# EAGLE design LoraLCD (EAGLE 9.6.0)

## Sheet 1 of 8: Mikrokontroller
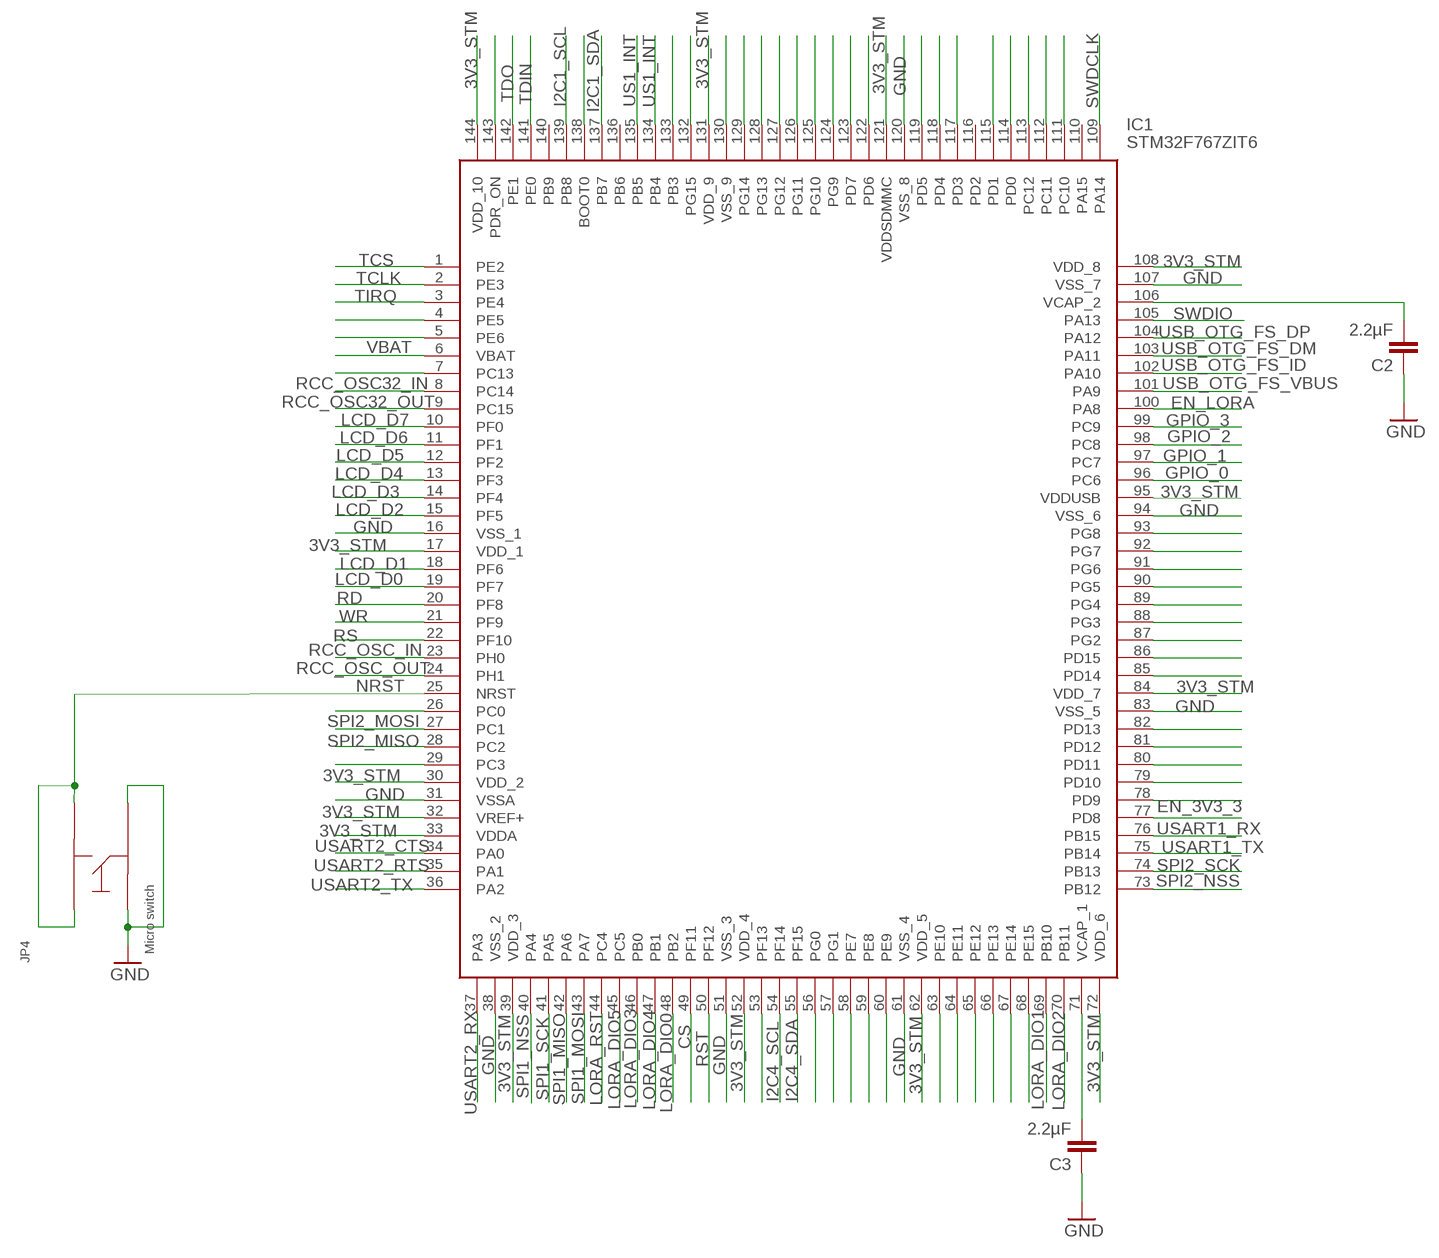
[diagram p0: schematic, sheet 1]

### Parts
C2  2.2µF  C-EUC0402K  [C0402K]
C3  2.2µF  C-EUC0402K  [C0402K]
IC1  STM32F767ZIT6  [QFP50P2200X2200X160-144N]
JP4  MICRO_SWITCH_6MM  [SKQGADE010]

### Nets
3V3_STM: IC1.17(VDD_1) IC1.30(VDD_2) IC1.32(VREF+) IC1.33(VDDA) IC1.39(VDD_3) IC1.52(VDD_4) IC1.62(VDD_5) IC1.72(VDD_6) IC1.84(VDD_7) IC1.95(VDDUSB) IC1.108(VDD_8) IC1.121(VDDSDMMC) IC1.131(VDD_9) IC1.144(VDD_10) ; also sheet 2
CS: IC1.49(PF11) ; also sheet 8
EN_3V3_3: IC1.77(PD8) ; also sheet 6
EN_LORA: IC1.100(PA8) ; also sheet 5
GND: C2.1 C3.1 IC1.16(VSS_1) IC1.31(VSSA) IC1.38(VSS_2) IC1.51(VSS_3) IC1.61(VSS_4) IC1.83(VSS_5) IC1.94(VSS_6) IC1.107(VSS_7) IC1.120(VSS_8) JP4.P$3 JP4.P$4 ; also sheet 2,3,4,5,6,7,8
GPIO_0: IC1.96(PC6) ; also sheet 6
GPIO_1: IC1.97(PC7) ; also sheet 6
GPIO_2: IC1.98(PC8) ; also sheet 6
GPIO_3: IC1.99(PC9) ; also sheet 6
I2C1_SCL: IC1.139(PB8) ; also sheet 6,7
I2C1_SDA: IC1.137(PB7) ; also sheet 6,7
I2C4_SCL: IC1.54(PF14) ; also sheet 6,7
I2C4_SDA: IC1.55(PF15) ; also sheet 6,7
LCD_D0: IC1.19(PF7) ; also sheet 8
LCD_D1: IC1.18(PF6) ; also sheet 8
LCD_D2: IC1.15(PF5) ; also sheet 8
LCD_D3: IC1.14(PF4) ; also sheet 8
LCD_D4: IC1.13(PF3) ; also sheet 8
LCD_D5: IC1.12(PF2) ; also sheet 8
LCD_D6: IC1.11(PF1) ; also sheet 8
LCD_D7: IC1.10(PF0) ; also sheet 8
LORA_DIO0: IC1.48(PB2) ; also sheet 5
LORA_DIO1: IC1.69(PB10) ; also sheet 5
LORA_DIO2: IC1.70(PB11) ; also sheet 5
LORA_DIO3: IC1.46(PB0) ; also sheet 5
LORA_DIO4: IC1.47(PB1) ; also sheet 5
LORA_DIO5: IC1.45(PC5) ; also sheet 5
LORA_RST: IC1.44(PC4) ; also sheet 5
N$4: IC1.4(PE5)
N$5: IC1.5(PE6)
N$6: C2.2 IC1.106(VCAP_2)
N$7: IC1.7(PC13)
N$26: IC1.26(PC0)
N$29: IC1.29(PC3)
N$53: IC1.53(PF13)
N$56: IC1.56(PG0)
N$57: IC1.57(PG1)
N$58: IC1.58(PE7)
N$59: IC1.59(PE8)
N$60: IC1.60(PE9)
N$63: IC1.63(PE10)
N$64: IC1.64(PE11)
N$65: IC1.65(PE12)
N$66: IC1.66(PE13)
N$67: IC1.67(PE14)
N$68: IC1.68(PE15)
N$71: C3.2 IC1.71(VCAP_1)
N$88: IC1.93(PG8)
N$89: IC1.92(PG7)
N$90: IC1.91(PG6)
N$91: IC1.90(PG5)
N$92: IC1.89(PG4)
N$93: IC1.88(PG3)
N$94: IC1.87(PG2)
N$95: IC1.86(PD15)
N$96: IC1.85(PD14)
N$99: IC1.82(PD13)
N$100: IC1.81(PD12)
N$101: IC1.80(PD11)
N$102: IC1.79(PD10)
N$103: IC1.78(PD9)
N$110: IC1.143(PDR_ON)
N$115: IC1.138(BOOT0)
N$120: IC1.133(PB3)
N$121: IC1.132(PG15)
N$123: IC1.130(VSS_9)
N$124: IC1.129(PG14)
N$125: IC1.128(PG13)
N$126: IC1.127(PG12)
N$127: IC1.126(PG11)
N$128: IC1.125(PG10)
N$129: IC1.124(PG9)
N$130: IC1.123(PD7)
N$131: IC1.122(PD6)
N$134: IC1.119(PD5)
N$135: IC1.118(PD4)
N$136: IC1.117(PD3)
N$138: IC1.115(PD1)
N$139: IC1.114(PD0)
N$140: IC1.113(PC12)
N$141: IC1.112(PC11)
N$142: IC1.111(PC10)
NRST: IC1.25(NRST) JP4.P$1 JP4.P$2 ; also sheet 2
RCC_OSC32_IN: IC1.8(PC14) ; also sheet 3
RCC_OSC32_OUT: IC1.9(PC15) ; also sheet 3
RCC_OSC_IN: IC1.23(PH0) ; also sheet 3
RCC_OSC_OUT: IC1.24(PH1) ; also sheet 3
RD: IC1.20(PF8) ; also sheet 8
RS: IC1.22(PF10) ; also sheet 8
RST: IC1.50(PF12) ; also sheet 8
SPI1_MISO: IC1.42(PA6) ; also sheet 5
SPI1_MOSI: IC1.43(PA7) ; also sheet 5
SPI1_NSS: IC1.40(PA4) ; also sheet 5
SPI1_SCK: IC1.41(PA5) ; also sheet 5
SPI2_MISO: IC1.28(PC2) ; also sheet 6,7
SPI2_MOSI: IC1.27(PC1) ; also sheet 6
SPI2_NSS: IC1.73(PB12) ; also sheet 6
SPI2_SCK: IC1.74(PB13) ; also sheet 6,7
SWDCLK: IC1.109(PA14) ; also sheet 2
SWDIO: IC1.105(PA13) ; also sheet 2
TCLK: IC1.2(PE3) ; also sheet 8
TCS: IC1.1(PE2) ; also sheet 8
TDIN: IC1.141(PE0) ; also sheet 8
TDO: IC1.142(PE1) ; also sheet 8
TIRQ: IC1.3(PE4) ; also sheet 8
US1_INT: IC1.134(PB4) IC1.135(PB5) ; also sheet 6
USART1_RX: IC1.76(PB15) ; also sheet 6
USART1_TX: IC1.75(PB14) ; also sheet 6
USART2_CTS: IC1.34(PA0) ; also sheet 6
USART2_RTS: IC1.35(PA1) ; also sheet 6
USART2_RX: IC1.37(PA3) ; also sheet 6
USART2_TX: IC1.36(PA2) ; also sheet 6
USB_OTG_FS_DM: IC1.103(PA11) ; also sheet 6
USB_OTG_FS_DP: IC1.104(PA12) ; also sheet 6
USB_OTG_FS_ID: IC1.102(PA10) ; also sheet 6
USB_OTG_FS_VBUS: IC1.101(PA9) ; also sheet 6
VBAT: IC1.6(VBAT) ; also sheet 4,6
WR: IC1.21(PF9) ; also sheet 8
Unconnected: IC1.110(PA15) IC1.116(PD2) IC1.136(PB6) IC1.140(PB9)

## Sheet 2 of 8: SWD - Code Laden
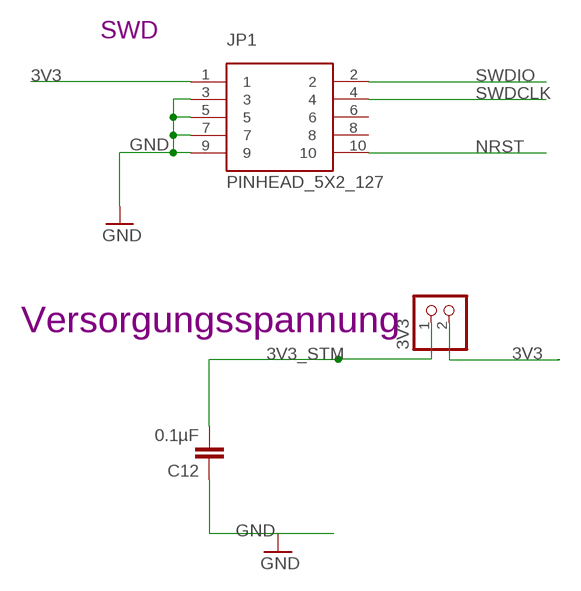
[diagram p1: schematic, sheet 2]

### Parts
3V3  PINHD-1X2  [1X02]
C12  0.1µF  C-EUC0402K  [C0402K]
JP1  PINHEAD_5X2_127  [PINHEAD_2X5_127]

### Nets
3V3: 3V3.2 JP1.1 ; also sheet 4,5,6,7,8
3V3_STM: 3V3.1 C12.2 ; also sheet 1
GND: C12.1 JP1.3 JP1.5 JP1.7 JP1.9 ; also sheet 1,3,4,5,6,7,8
NRST: JP1.10 ; also sheet 1
SWDCLK: JP1.4 ; also sheet 1
SWDIO: JP1.2 ; also sheet 1
Unconnected: JP1.6 JP1.8

### Notes on the sheet
- SWD
- Versorgungsspannung

## Sheet 3 of 8: Oszillator
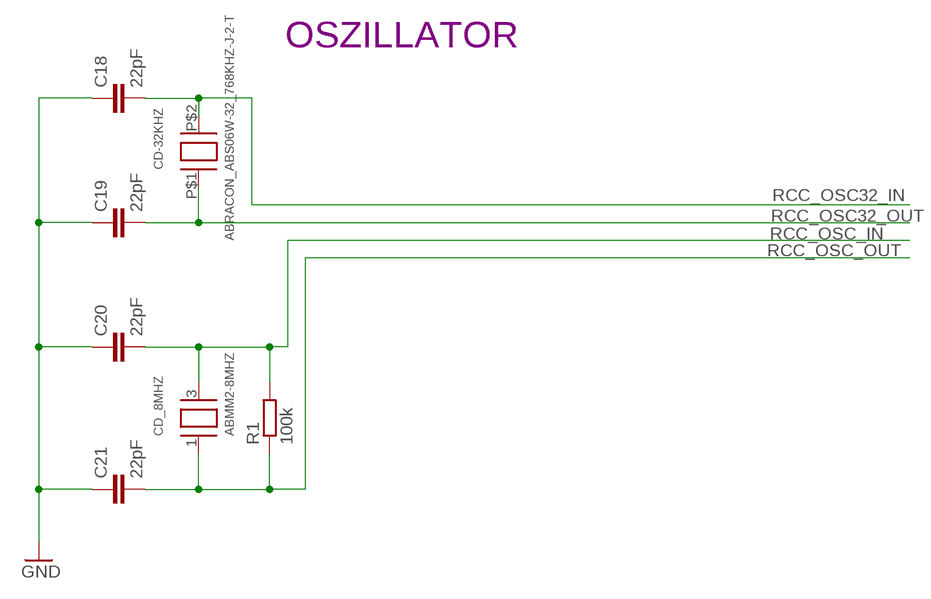
[diagram p2: schematic, sheet 3]

### Parts
C18  22pF  C-EUC0402K  [C0402K]
C19  22pF  C-EUC0402K  [C0402K]
C20  22pF  C-EUC0402K  [C0402K]
C21  22pF  C-EUC0402K  [C0402K]
CD-32KHZ  ABRACON_ABS06W-32_768KHZ-J-2-T  [2MM_X_1_2MM]
CD_8MHZ  ABMM2-8MHZ  [CRYSTAL_ABRACON_6MM_3.6MM]
R1  100k  R_0402WEB_0402  [C0402K]

### Nets
GND: C18.1 C19.1 C20.1 C21.1 ; also sheet 1,2,4,5,6,7,8
RCC_OSC32_IN: C18.2 CD-32KHZ.P$2(C1) ; also sheet 1
RCC_OSC32_OUT: C19.2 CD-32KHZ.P$1(C0) ; also sheet 1
RCC_OSC_IN: C20.2 CD_8MHZ.3(C1) R1.2 ; also sheet 1
RCC_OSC_OUT: C21.2 CD_8MHZ.1(C0) R1.1 ; also sheet 1

### Notes on the sheet
- OSZILLATOR

## Sheet 4 of 8: Supply
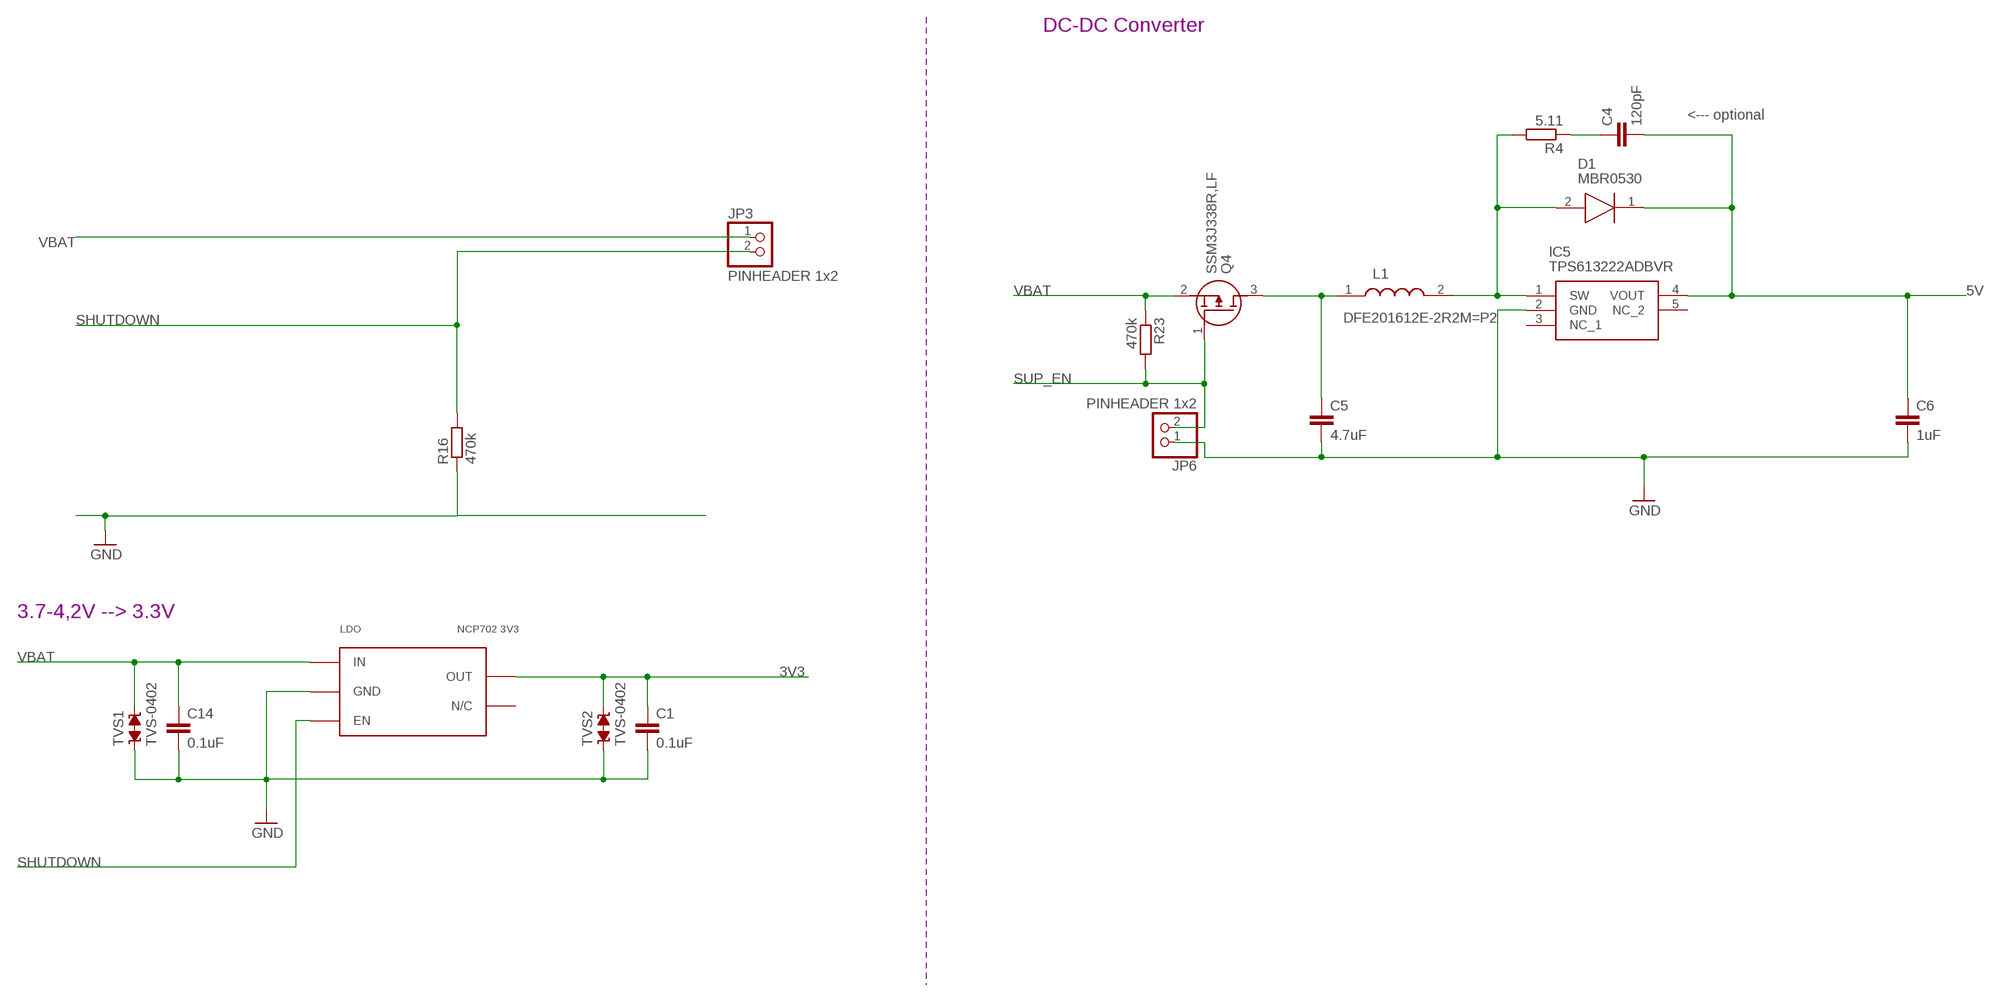
[diagram p3: schematic, sheet 4]

### Parts
C1  0.1uF  C-EUC0402K  [C0402K]
C4  120pF  C-EUC0402K  [C0402K]
C5  4.7uF  C-EUC0603K  [C0603K]
C6  1uF  C-EUC0603K  [C0603K]
C14  0.1uF  C-EUC0402K  [C0402K]
D1  MBR0530  [SOD3716X135N]
IC5  TPS613222ADBVR  [SOT95P280X145-5N]
JP3  PINHEADER 1x2  PINHD-1X2  [1X02]
JP6  PINHEADER 1x2  PINHD-1X2  [1X02]
L1  DFE201612E-2R2M=P2  [INDC2016X120N]
LDO  NCP702 3V3  NCP702  [SOT563]
Q4  SSM3J338R,LF  [SSM3J332RLFT]
R4  5.11  R-EU_R0402  [R0402]
R16  470k  R-EU_R0402  [R0402]
R23  470k  R-EU_R0402  [R0402]
TVS1  TVS-0402  [TVS0402]
TVS2  TVS-0402  [TVS0402]

### Nets
3V3: C1.1 LDO.P$5(OUT) TVS2.2 ; also sheet 2,5,6,7,8
5V: C4.2 C6.1 D1.1(K) IC5.4(VOUT) ; also sheet 6,8
GND: C1.2 C5.2 C6.2 C14.2 IC5.2(GND) JP6.1 LDO.P$2(GND) R16.1 TVS1.1 TVS2.1 ; also sheet 1,2,3,5,6,7,8
N$8: D1.2(A) IC5.1(SW) L1.2 R4.2
N$9: C4.1 R4.1
N$16: C5.1 L1.1 Q4.3(D)
SHUTDOWN: JP3.2 LDO.P$3(EN) R16.2
SUP_EN: JP6.2 Q4.1(G) R23.2
VBAT: C14.1 JP3.1 LDO.P$1(IN) Q4.2(S) R23.1 TVS1.2 ; also sheet 1,6
Unconnected: IC5.3(NC_1) IC5.5(NC_2) LDO.P$4(N/C)

### Notes on the sheet
- DC-DC Converter
- <--- optional
- 3.7-4,2V --> 3.3V

## Sheet 5 of 8: Lora
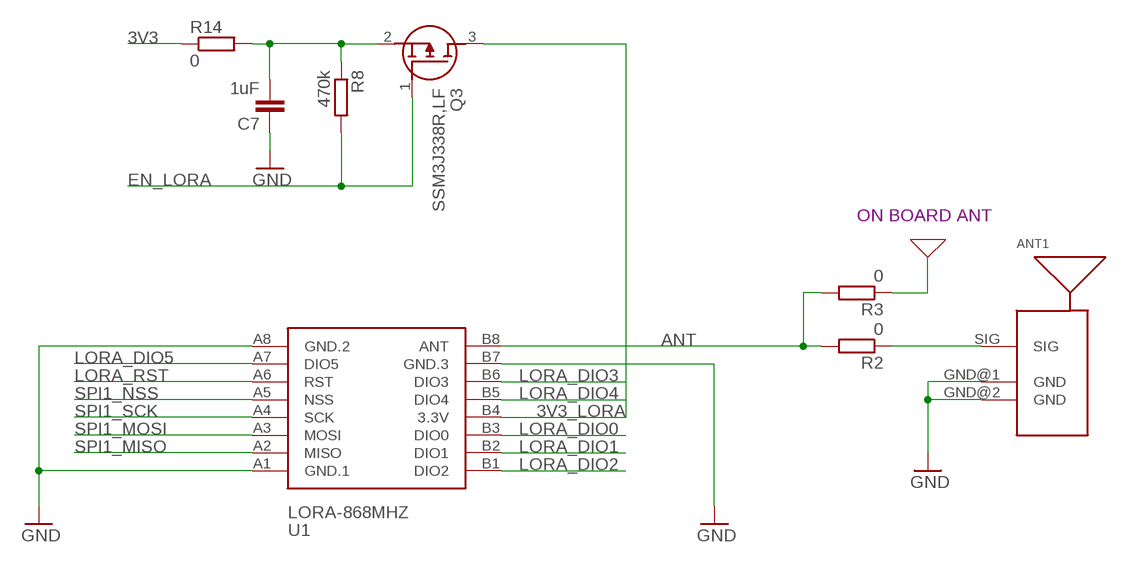
[diagram p4: schematic, sheet 5]

### Parts
ANT1  U.FL-R-SMT-1  [UFL_HIROSE]
C7  1uF  C-EUC0402K  [C0402K]
Q3  SSM3J338R,LF  [SSM3J332RLFT]
R2  0  R_0402WEB_0402  [C0402K]
R3  0  R_0402WEB_0402  [C0402K]
R8  470k  R-EU_R0402  [R0402]
R14  0  R-EU_R0402  [R0402]
U1  LORA-868MHZ  WIRELESS-LORA-RFM95W#SMD  [WIRELESS-LORA-RFM95W#SMD]

### Nets
3V3: R14.1 ; also sheet 2,4,6,7,8
3V3_LORA: Q3.3(D) U1.B4(3.3V)
ANT: R2.2 R3.2 U1.B8(ANT)
EN_LORA: Q3.1(G) R8.2 ; also sheet 1
GND: ANT1.GND@1(GND) ANT1.GND@2(GND) C7.1 U1.A1(GND.1) U1.A8(GND.2) U1.B7(GND.3) ; also sheet 1,2,3,4,6,7,8
HELIX_ANT: R3.1
LORA_DIO0: U1.B3(DIO0) ; also sheet 1
LORA_DIO1: U1.B2(DIO1) ; also sheet 1
LORA_DIO2: U1.B1(DIO2) ; also sheet 1
LORA_DIO3: U1.B6(DIO3) ; also sheet 1
LORA_DIO4: U1.B5(DIO4) ; also sheet 1
LORA_DIO5: U1.A7(DIO5) ; also sheet 1
LORA_RST: U1.A6(RST) ; also sheet 1
N$17: ANT1.SIG R2.1
N$23: C7.2 Q3.2(S) R8.1 R14.2
SPI1_MISO: U1.A2(MISO) ; also sheet 1
SPI1_MOSI: U1.A3(MOSI) ; also sheet 1
SPI1_NSS: U1.A5(NSS) ; also sheet 1
SPI1_SCK: U1.A4(SCK) ; also sheet 1

### Notes on the sheet
- ON BOARD ANT

## Sheet 6 of 8: Connector
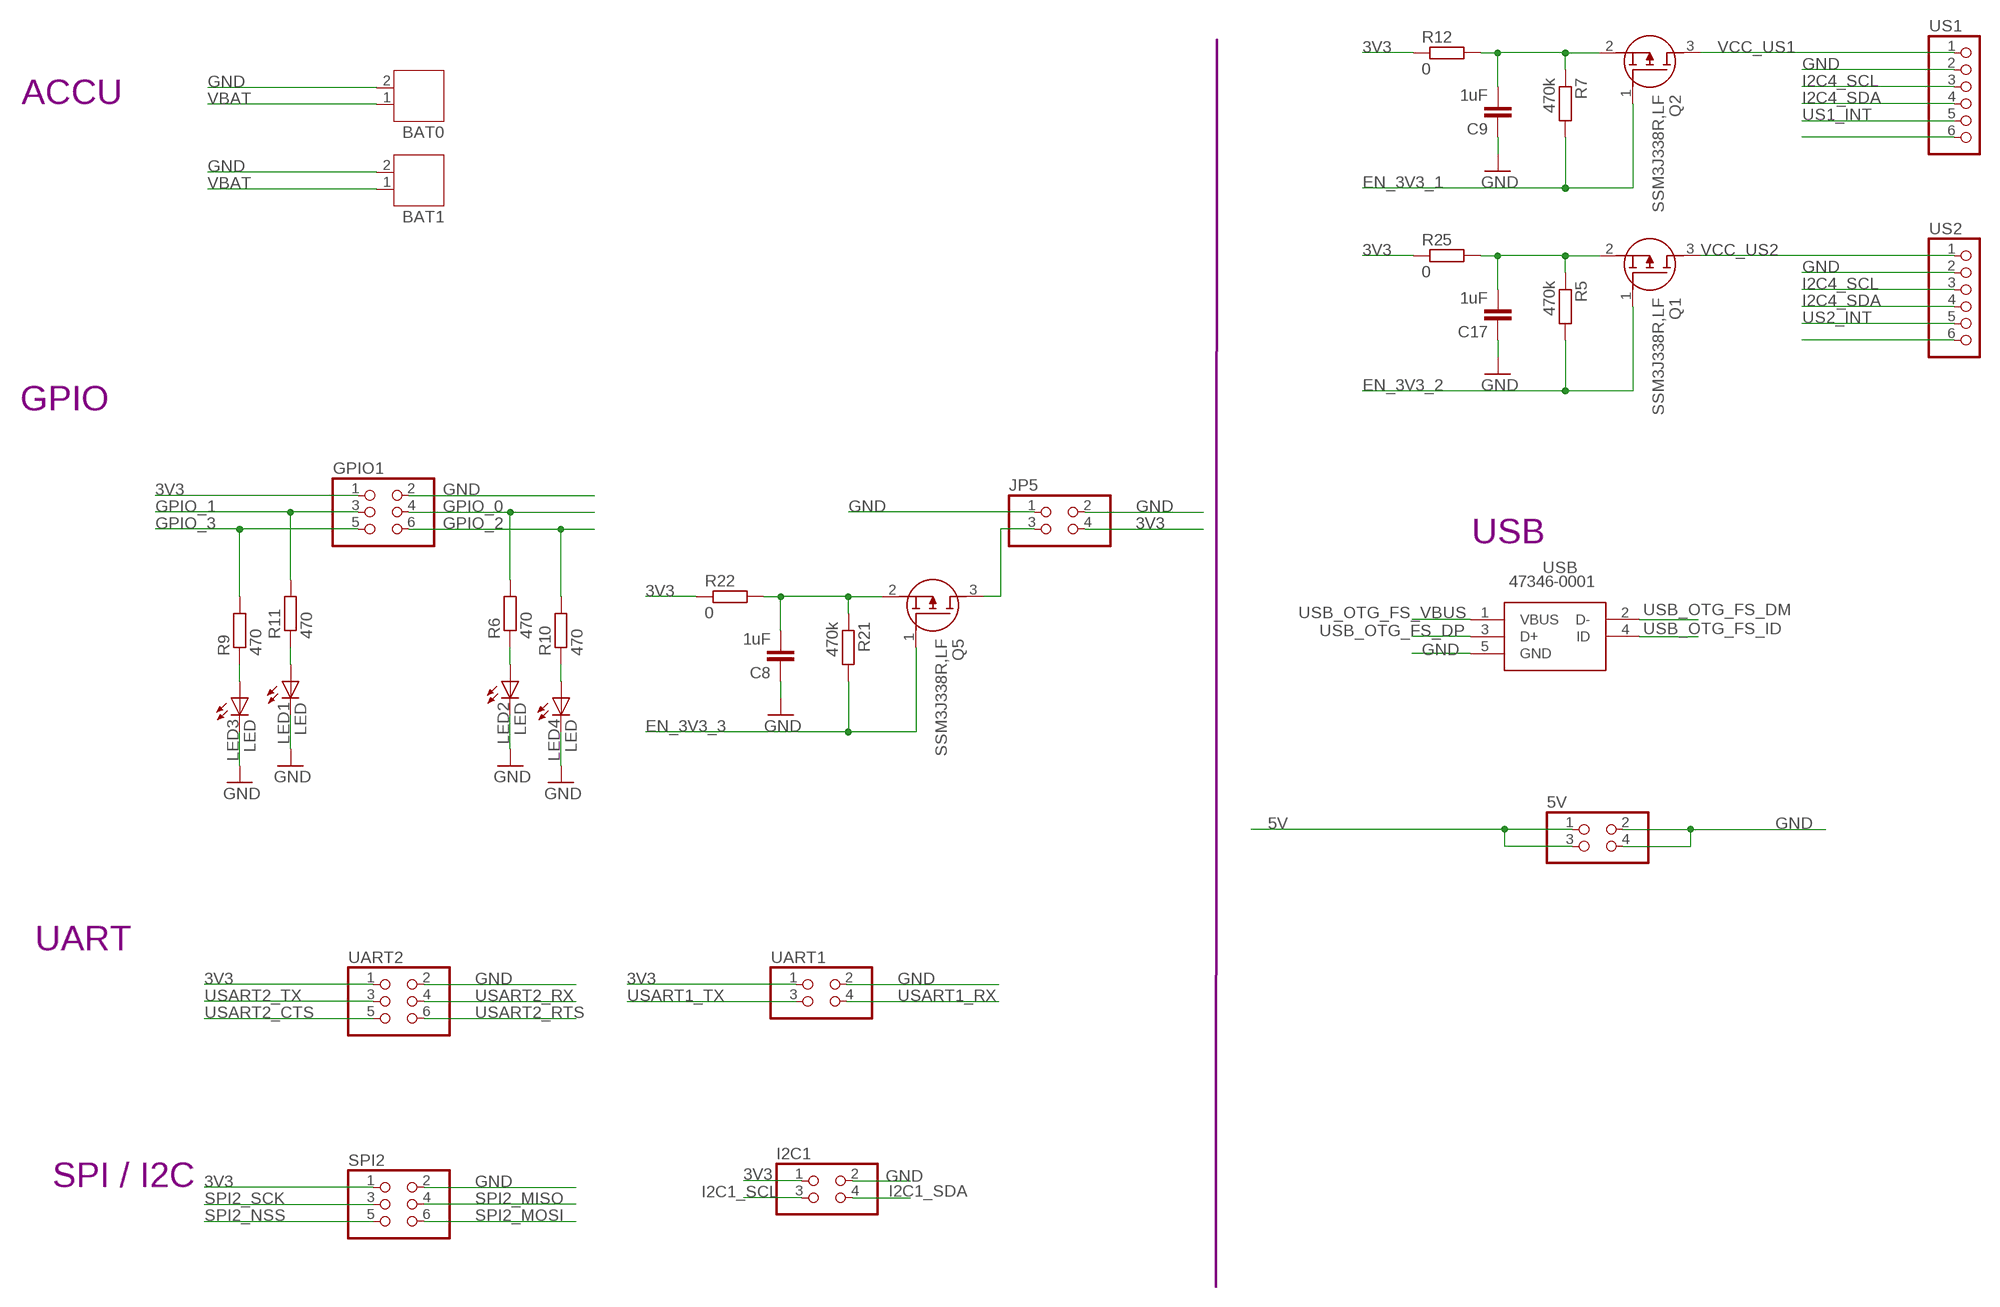
[diagram p5: schematic, sheet 6]

### Parts
5V  PINHD-2X2  [2X02]
BAT0  JST-PH2  [JST-PH2]
BAT1  JST-PH2  [JST-PH2]
C8  1uF  C-EUC0402K  [C0402K]
C9  1uF  C-EUC0402K  [C0402K]
C17  1uF  C-EUC0402K  [C0402K]
GPIO1  PINHD-2X3  [2X03]
I2C1  PINHD-2X2  [2X02]
JP5  PINHD-2X2  [2X02]
LED1  LED  [0603_AK]
LED2  LED  [0603_AK]
LED3  LED  [0603_AK]
LED4  LED  [0603_AK]
Q1  SSM3J338R,LF  [SSM3J332RLFT]
Q2  SSM3J338R,LF  [SSM3J332RLFT]
Q5  SSM3J338R,LF  [SSM3J332RLFT]
R5  470k  R-EU_R0402  [R0402]
R6  470  R-EU_R0402  [R0402]
R7  470k  R-EU_R0402  [R0402]
R9  470  R-EU_R0402  [R0402]
R10  470  R-EU_R0402  [R0402]
R11  470  R-EU_R0402  [R0402]
R12  0  R-EU_R0402  [R0402]
R21  470k  R-EU_R0402  [R0402]
R22  0  R-EU_R0402  [R0402]
R25  0  R-EU_R0402  [R0402]
SPI2  PINHD-2X3  [2X03]
UART1  PINHD-2X2  [2X02]
UART2  PINHD-2X3  [2X03]
US1  PINHD-1X6  [1X06]
US2  PINHD-1X6  [1X06]
USB  47346-0001  [47346-0001]

### Nets
3V3: GPIO1.1 I2C1.1 JP5.4 R12.1 R22.1 R25.1 SPI2.1 UART1.1 UART2.1 ; also sheet 2,4,5,7,8
5V: 5V.1 5V.3 ; also sheet 4,8
EN_3V3_1: Q2.1(G) R7.2
EN_3V3_2: Q1.1(G) R5.2
EN_3V3_3: Q5.1(G) R21.2 ; also sheet 1
GND: 5V.2 5V.4 BAT0.2 BAT1.2 C8.1 C9.1 C17.1 GPIO1.2 I2C1.2 JP5.1 JP5.2 LED1.K(C) LED2.K(C) LED3.K(C) LED4.K(C) SPI2.2 UART1.2 UART2.2 US1.2 US2.2 USB.5(GND) ; also sheet 1,2,3,4,5,7,8
GPIO_0: GPIO1.4 R6.2 ; also sheet 1
GPIO_1: GPIO1.3 R11.2 ; also sheet 1
GPIO_2: GPIO1.6 R10.2 ; also sheet 1
GPIO_3: GPIO1.5 R9.2 ; also sheet 1
I2C1_SCL: I2C1.3 ; also sheet 1,7
I2C1_SDA: I2C1.4 ; also sheet 1,7
I2C4_SCL: US1.3 US2.3 ; also sheet 1,7
I2C4_SDA: US1.4 US2.4 ; also sheet 1,7
N$24: LED1.A R11.1
N$25: LED2.A R6.1
N$27: US2.6
N$28: C17.2 Q1.2(S) R5.1 R25.2
N$30: LED3.A R9.1
N$31: LED4.A R10.1
N$32: C8.2 Q5.2(S) R21.1 R22.2
N$33: JP5.3 Q5.3(D)
N$34: C9.2 Q2.2(S) R7.1 R12.2
PS: US1.6
SPI2_MISO: SPI2.4 ; also sheet 1,7
SPI2_MOSI: SPI2.6 ; also sheet 1
SPI2_NSS: SPI2.5 ; also sheet 1
SPI2_SCK: SPI2.3 ; also sheet 1,7
US1_INT: US1.5 ; also sheet 1
US2_INT: US2.5
USART1_RX: UART1.4 ; also sheet 1
USART1_TX: UART1.3 ; also sheet 1
USART2_CTS: UART2.5 ; also sheet 1
USART2_RTS: UART2.6 ; also sheet 1
USART2_RX: UART2.4 ; also sheet 1
USART2_TX: UART2.3 ; also sheet 1
USB_OTG_FS_DM: USB.2(D-) ; also sheet 1
USB_OTG_FS_DP: USB.3(D+) ; also sheet 1
USB_OTG_FS_ID: USB.4(ID) ; also sheet 1
USB_OTG_FS_VBUS: USB.1(VBUS) ; also sheet 1
VBAT: BAT0.1 BAT1.1 ; also sheet 1,4
VCC_US1: Q2.3(D) US1.1
VCC_US2: Q1.3(D) US2.1

### Notes on the sheet
- ACCU
- GPIO
- USB
- UART
- SPI / I2C

## Sheet 7 of 8: I2C
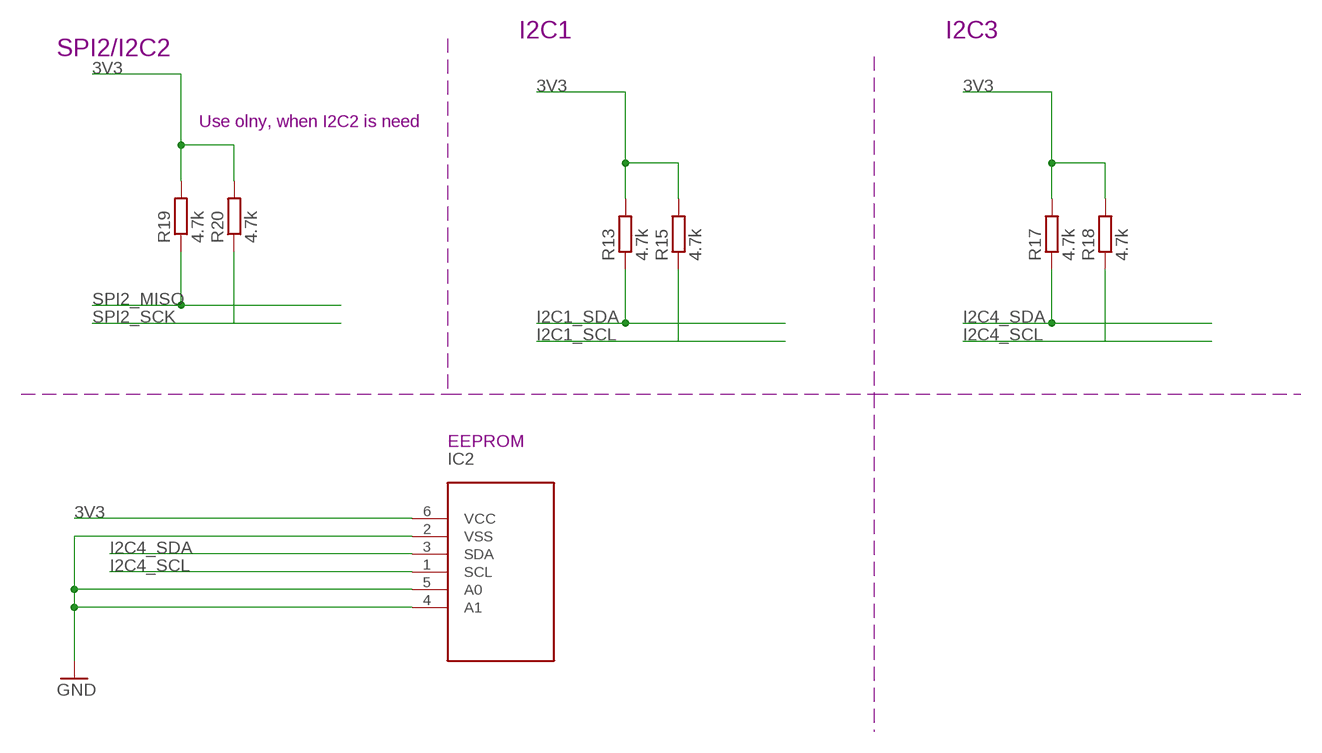
[diagram p6: schematic, sheet 7]

### Parts
IC2  24AA025E64T-I/OT  24AA025E48T-I/OT  [SOT23-6]
R13  4.7k  R_0402WEB_0402  [C0402K]
R15  4.7k  R_0402WEB_0402  [C0402K]
R17  4.7k  R_0402WEB_0402  [C0402K]
R18  4.7k  R_0402WEB_0402  [C0402K]
R19  4.7k  R_0402WEB_0402  [C0402K]
R20  4.7k  R_0402WEB_0402  [C0402K]

### Nets
3V3: IC2.6(VCC) R13.2 R15.2 R17.2 R18.2 R19.2 R20.2 ; also sheet 2,4,5,6,8
GND: IC2.2(VSS) IC2.4(A1) IC2.5(A0) ; also sheet 1,2,3,4,5,6,8
I2C1_SCL: R15.1 ; also sheet 1,6
I2C1_SDA: R13.1 ; also sheet 1,6
I2C4_SCL: IC2.1(SCL) R18.1 ; also sheet 1,6
I2C4_SDA: IC2.3(SDA) R17.1 ; also sheet 1,6
SPI2_MISO: R19.1 ; also sheet 1,6
SPI2_SCK: R20.1 ; also sheet 1,6

### Notes on the sheet
- I2C1 | I2C3
- SPI2/I2C2
- Use olny, when I2C2 is need
- EEPROM

## Sheet 8 of 8: LCD
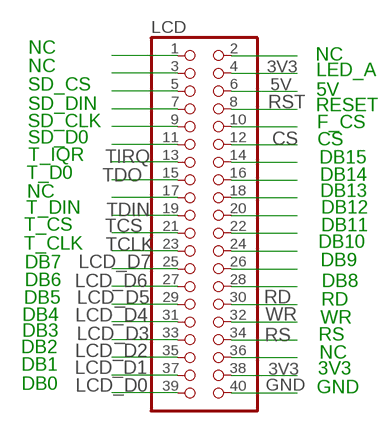
[diagram p7: schematic, sheet 8]

### Parts
LCD  PINHD-2X20  [2X20]

### Nets
3V3: LCD.4 LCD.38 ; also sheet 2,4,5,6,7
5V: LCD.6 ; also sheet 4,6
CS: LCD.12 ; also sheet 1
GND: LCD.40 ; also sheet 1,2,3,4,5,6,7
LCD_D0: LCD.39 ; also sheet 1
LCD_D1: LCD.37 ; also sheet 1
LCD_D2: LCD.35 ; also sheet 1
LCD_D3: LCD.33 ; also sheet 1
LCD_D4: LCD.31 ; also sheet 1
LCD_D5: LCD.29 ; also sheet 1
LCD_D6: LCD.27 ; also sheet 1
LCD_D7: LCD.25 ; also sheet 1
N$35: LCD.1
N$36: LCD.2
N$37: LCD.3
N$39: LCD.5
N$41: LCD.7
N$42: LCD.9
N$43: LCD.10
N$44: LCD.11
N$45: LCD.14
N$46: LCD.16
N$47: LCD.17
N$48: LCD.18
N$51: LCD.20
N$52: LCD.22
N$54: LCD.24
N$55: LCD.26
N$61: LCD.28
N$62: LCD.36
RD: LCD.30 ; also sheet 1
RS: LCD.34 ; also sheet 1
RST: LCD.8 ; also sheet 1
TCLK: LCD.23 ; also sheet 1
TCS: LCD.21 ; also sheet 1
TDIN: LCD.19 ; also sheet 1
TDO: LCD.15 ; also sheet 1
TIRQ: LCD.13 ; also sheet 1
WR: LCD.32 ; also sheet 1

### Notes on the sheet
- NC
- NC
- NC | LED_A
- SD_CS | 5V
- SD_DIN | RESET
- SD_CLK | F_CS
- SD_D0 | CS
- T_IQR | DB15
- T_D0 | DB14
- NC | DB13
- T_DIN | DB12
- T_CS | DB11
- T_CLK | DB10
- DB7 | DB9
- DB6 | DB8
- DB5 | RD
- DB4 | WR
- DB3 | RS
- DB2
- NC
- DB1 | 3V3
- DB0 | GND

## Library data of the parts
3V3 = pinhead:PINHD-1X2: PIN HEADER
5V I2C1 JP5 UART1 = pinhead:PINHD-2X2: PIN HEADER
ANT1 = sicom_universal:U.FL-R-SMT-1; IPN: 14; MF: HIROSE Connector; MPN: U.FL-R-SMT-1(10)
BAT0 BAT1 = sicom_universal:JST-PH2; IPN: 36; MF: JST Sales America Inc.; MPN: B2B-PH-K-S; OC_FARNELL: unknown
C1 = rcl:C-EU: CAPACITOR, European symbol; IPN: 10; MF: NOVA; MPN: CCC-23; OC_FARNELL: 1399538; SPICEPREFIX: C
C2 C3 C12 C18-C21 = rcl:C-EU: CAPACITOR, European symbol; SPICEPREFIX: C
C4 = rcl:C-EU: CAPACITOR, European symbol; MPN: GRM1555C1H121JA01D; OC_FARNELL: unknown; SPICEPREFIX: C
C5 = rcl:C-EU: CAPACITOR, European symbol; IPN: 95; MF: Taiyo Yuden; MPN: JMK107BB7475KA-T; OC_FARNELL: unknown; SPICEPREFIX: C
C6-C9 C17 = rcl:C-EU: CAPACITOR, European symbol; OC_FARNELL: unknown; SPICEPREFIX: C
C14 = rcl:C-EU: CAPACITOR, European symbol; IPN: 10; OC_FARNELL: unknown; SPICEPREFIX: C
CD-32KHZ = sicom_universal:ABRACON_ABS06W-32_768KHZ-J-2-T
CD_8MHZ = sicom_universal:ABMM2-8MHZ; MPN: ABMM2-8.0000MHZ-E1-T
D1 = SamacSys_Parts:MBR0530: ON SEMICONDUCTOR - MBR0530 - DIODE, SCHOTTKY, 0.5A, 30V, SOD-123 Source: Datasheet <https://componentsearchengine.com/Datasheets/1/MBR0530.pdf>; DESCRIPTION: ON SEMICONDUCTOR - MBR0530 - DIODE, SCHOTTKY, 0.5A, 30V, SOD-123; HEIGHT: 1.35mm; IPN: 96; MANUFACTURER_NAME: ON Semiconductor; MANUFACTURER_PART_NUMBER: MBR0530; MOUSER_PART_NUMBER: 512-MBR0530; MOUSER_PRICE-STOCK: https://www.mouser.com/Search/Refine.aspx?Keyword=512-MBR0530
GPIO1 SPI2 UART2 = pinhead:PINHD-2X3: PIN HEADER
IC1 = STM32F767ZIT6:STM32F767ZIT6: STMICROELECTRONICS - STM32F767ZIT6 - MCU, 32BIT, CORTEX-M7, 216MHZ, LQFP-144 Source: Datasheet <https://componentsearchengine.com/Datasheets/1/STM32F767ZIT6.pdf>; DESCRIPTION: STMICROELECTRONICS - STM32F767ZIT6 - MCU, 32BIT, CORTEX-M7, 216MHZ, LQFP-144; HEIGHT: 1.6mm; MANUFACTURER_NAME: STMicroelectronics; MANUFACTURER_PART_NUMBER: STM32F767ZIT6; MOUSER_PART_NUMBER: 511-STM32F767ZIT6; MOUSER_PRICE-STOCK: https://www.mouser.com/Search/Refine.aspx?Keyword=511-STM32F767ZIT6
IC2 = sicom_universal:24AA025E48T-I/OT; IPN: 92; MF: Microchip Technology; MPN: 24AA025E64T-I/OT; OC_FARNELL: unknown
IC5 = SamacSys_Parts:TPS613222ADBVR: 6-uA Quiescent Current, 1.8-A Switch Current Boost Converter Source: Datasheet <http://www.ti.com/lit/gpn/tps61322>; DESCRIPTION: 6-uA Quiescent Current, 1.8-A Switch Current Boost Converter; HEIGHT: 1.45mm; MANUFACTURER_NAME: Texas Instruments; MANUFACTURER_PART_NUMBER: TPS613222ADBVR; MOUSER_PART_NUMBER: 595-TPS613222ADBVR; MOUSER_PRICE-STOCK: https://www.mouser.com/Search/Refine.aspx?Keyword=595-TPS613222ADBVR
JP1 = sicom_universal:PINHEAD_5X2_127: Pinheader 5 x 2 1,27mm pitch Mouser <http://www.mouser.de/ProductDetail/FCI/20021121-00010C4LF/?qs=%2fha2pyFaduhk6vEDe5a0MwjRWUz4Zk9Fskpe5qL0Xo%2fyZkFkIBBW%2flKXwnPu0N9C>; MPN: 3221-10-0100-00
JP3 JP6 = pinhead:PINHD-1X2: PIN HEADER; OC_FARNELL: unknown
JP4 = sicom_universal:MICRO_SWITCH_6MM: Micro switch, suitable for CK 6mm components DigiKey <http://www.digikey.de/product-detail/de/PTS645SH50SMTR92%20LFS/CKN9085CT-ND/1146817>; IPN: 81; MF: ALPS; MPN: SKQGADE010; OC_FARNELL: unknown
L1 = SamacSys_Parts:DFE201612E-2R2M=P2: DFE201612E Series Inductor 2.2uH +/-20% 0806 (2016) Source: Datasheet <https://componentsearchengine.com/Datasheets/1/DFE201612E-2R2M=P2.pdf>; DESCRIPTION: DFE201612E Series Inductor 2.2uH +/-20% 0806 (2016); HEIGHT: 1.2mm; MANUFACTURER_NAME: Murata Electronics; MANUFACTURER_PART_NUMBER: DFE201612E-2R2M=P2; MOUSER_PART_NUMBER: 81-DFE201612E-2R2MP2; MOUSER_PRICE-STOCK: https://www.mouser.com/Search/Refine.aspx?Keyword=81-DFE201612E-2R2MP2
LCD = pinhead:PINHD-2X20: PIN HEADER
LDO = sicom_universal:NCP702: NCP702 200 mA, Ultra-Low Quiescent Current, Ultra-Low Noise, LDO Linear Voltage Regulator Noise sensitive applications such as Phase Locked Loops, Oscillators, Frequency Synthesizers, Low Noise Amplifiers and other Precision Instrumentation require very clean power supplies. The NCP702 is a 200 mA LDO that provides the engineer with a very stable, accurate voltage with ultra−low noise and very high Power Supply Rejection Ratio (PSRR), making it suitable for RF applications. The device doesn’t require an additional noise bypass capacitor to achieve ultra−low noise performance. In order to optimize performance for battery operated portable applications, the NCP702 employs an Adaptive Ground Current feature for ultra−low ground current consumption during light−load conditions.; IPN: 67; MANUFACTURE_NUMBER: NCP702SN33T1G; MF: ON Semiconductor; MOUSER_PART_NUMBER: 863-NCP702SN33T1G; MPN: NCP702SN33T1G; OC_FARNELL: unknown; PACKAGE: TSOP-5
LED1-LED4 = sicom_universal:LED; OC_FARNELL: unknown
Q1-Q5 = SamacSys_Parts:SSM3J338R,LF: MOSFET Small-signal MOSFET Vdss= -12V, ID= -6A Source: Datasheet <https://componentsearchengine.com/Datasheets/1/SSM3J338R,LF.pdf>; DESCRIPTION: MOSFET Small-signal MOSFET Vdss= -12V, ID= -6A; HEIGHT: mm; MANUFACTURER_NAME: Toshiba; MANUFACTURER_PART_NUMBER: SSM3J338R,LF; MOUSER_PART_NUMBER: 757-SSM3J338RLF
R1 = sicom_universal:R_0402
R2 R3 R13 R15 R17-R20 = sicom_universal:R_0402; OC_FARNELL: unknown
R4 = rcl:R-EU_: RESISTOR, European symbol; MF: Yageo; MPN: RC0402FR-132M2L; OC_FARNELL: unknown; SPICEPREFIX: R
R5 R7 R8 R12 R14 R21-R23 R25 = rcl:R-EU_: RESISTOR, European symbol; SPICEPREFIX: R
R6 R9-R11 R16 = rcl:R-EU_: RESISTOR, European symbol; OC_FARNELL: unknown; SPICEPREFIX: R
TVS1 TVS2 = supressor:TVS-: TVS BI-DIRECTIONAL; IPN: 17; MF: Littelfuse; MPN: PESD0402-140; OC_FARNELL: unknown
U1 = diy-modules:WIRELESS-LORA-RFM95W: 868/915 MHz LoRa Radio Transceiver Module based on SX1276 chip Click here to find device on ebay.com <http://www.ebay.com/sch/RFM95W+transceiver>
US1 US2 = pinhead:PINHD-1X6: PIN HEADER
USB = usb_connector:47346-0001: Micro USB B Receptacle Bottom Mount Assy Molex Right Angle SMT Type B Version 2.0 Micro USB Connector Socket, 30 V ac, 1A 47352 MICRO-USB Source: Datasheet <http://www.molex.com/pdm_docs/sd/473460001_sd.pdf>; DESCRIPTION: Micro USB B Receptacle Bottom Mount Assy Molex Right Angle SMT Type B Version 2.0 Micro USB Connector Socket, 30 V ac, 1A 47352 MICRO-USB; HEIGHT: mm; MANUFACTURER_NAME: Molex; MANUFACTURER_PART_NUMBER: 47346-0001

## Board
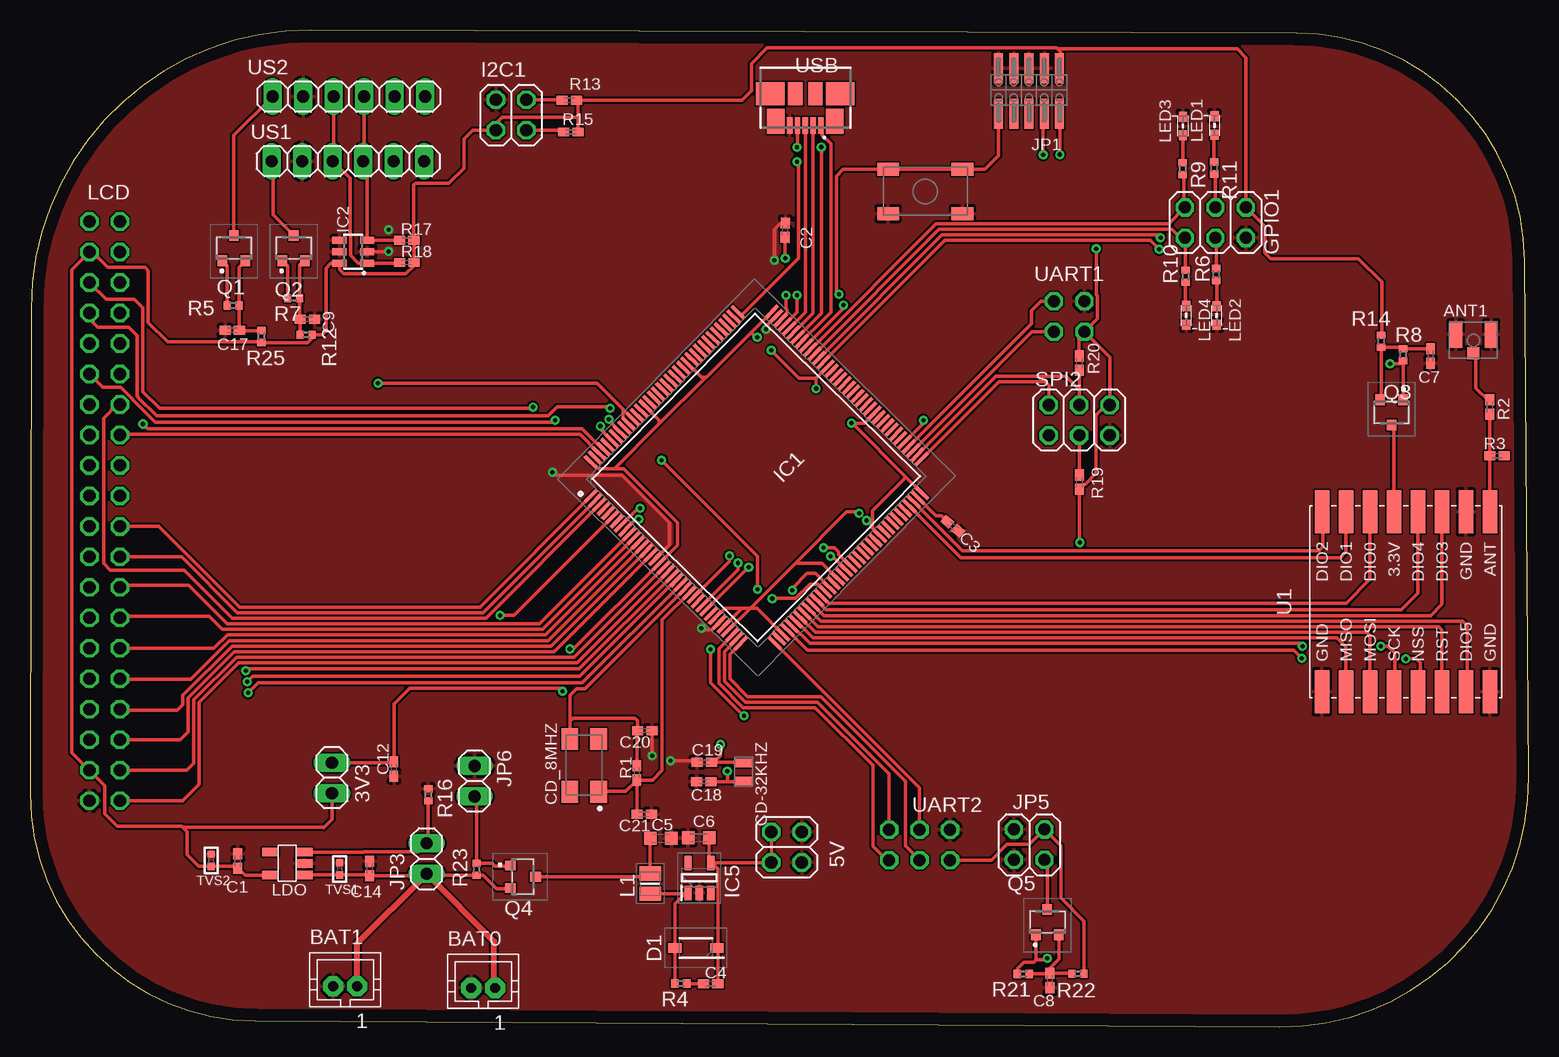
[diagram p8: board, top side]
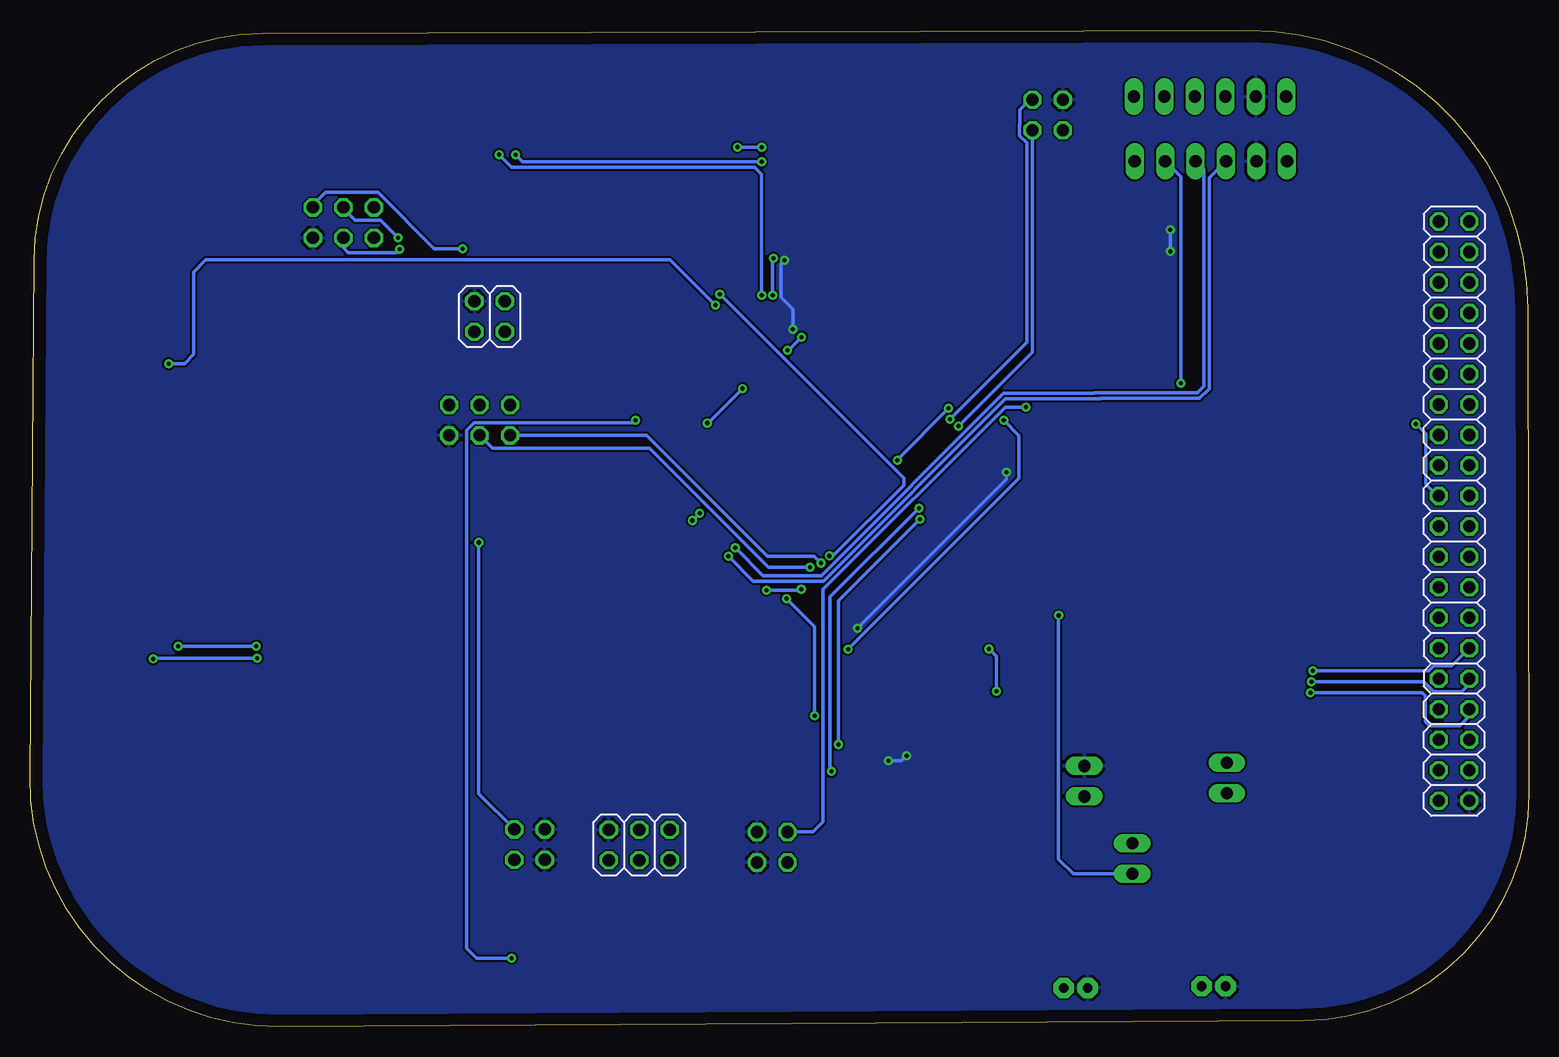
[diagram p9: board, bottom side, seen from below]

Size 124.94 x 83.07 mm. Coordinates in mm from the lower left corner, seen from the top.
Outline: 0.09,59.9 0,19.41 arc90 18.75,0.5 104.2,0 arc91 124.94,20.78 124.6,63.85 arc89 105.57,82.8 23.4,83.07 arc90 0.09,59.9
Copper layers (1*16): Top 0.035mm / dielectric 1.5mm / Bottom 0.035mm
Design rules "default": minimum track width 6mil, minimum drill 0.35mm, track to track 6mil, track to pad 6mil, pad to pad 6mil, via to via 6mil, smd to smd 6mil, copper to edge 40mil, drill to drill 6mil, minimum pad ring 10mil, minimum via ring 8mil, stop-mask expansion 4mil, vias tented up to drill 0mil, thermal gap 10mil

### Footprints (pad centres in the part's own frame; a part is rotated, then mirrored left to right if it is on the bottom)
1X02 = drill 1.016 long: 1 -1.27,0; 2 1.27,0
2X02 = drill 1.016 octagon: 1 -1.27,-1.27; 2 -1.27,1.27; 3 1.27,-1.27; 4 1.27,1.27
UFL_HIROSE = smd 1.05 x 2.2: GND@1 -1.475,0; GND@2 1.475,0 | smd 1 x 1: SIG 0,-1.575
JST-PH2 = drill 0.813 pad 1.676 octagon: 1 1,0; 2 -1,0
C0402K = smd 0.925 x 0.74: 1 -0.6,0; 2 0.6,0
C0603K = smd 1.05 x 1.08: 1 -0.875,0; 2 0.875,0
2MM_X_1_2MM = smd 0.7 x 1.4: P$1 -0.75,0; P$2 0.75,0
CRYSTAL_ABRACON_6MM_3.6MM = smd 1.8 x 1.4: 1 -2.2,-1.2; 2 2.2,-1.2; 3 2.2,1.2; 4 -2.2,1.2
SOD3716X135N = smd 1.15 x 0.8: 1 -1.75,0; 2 1.75,0
2X03 = drill 1.016 octagon: 1 -2.54,-1.27; 2 -2.54,1.27; 3 0,-1.27; 4 0,1.27; 5 2.54,-1.27; 6 2.54,1.27
QFP50P2200X2200X160-144N = smd 1.475 x 0.3: 1 -10.738,8.75; 2 -10.738,8.25; 3 -10.738,7.75; 4 -10.738,7.25; 5 -10.738,6.75; 6 -10.738,6.25; 7 -10.738,5.75; 8 -10.738,5.25; 9 -10.738,4.75; 10 -10.738,4.25; 11 -10.738,3.75; 12 -10.738,3.25; 13 -10.738,2.75; 14 -10.738,2.25; 15 -10.738,1.75; 16 -10.738,1.25; 17 -10.738,0.75; 18 -10.738,0.25; 19 -10.738,-0.25; 20 -10.738,-0.75; 21 -10.738,-1.25; 22 -10.738,-1.75; 23 -10.738,-2.25; 24 -10.738,-2.75; 25 -10.738,-3.25; 26 -10.738,-3.75; 27 -10.738,-4.25; 28 -10.738,-4.75; 29 -10.738,-5.25; 30 -10.738,-5.75; 31 -10.738,-6.25; 32 -10.738,-6.75; 33 -10.738,-7.25; 34 -10.738,-7.75; 35 -10.738,-8.25; 36 -10.738,-8.75; 73 10.738,-8.75; 74 10.738,-8.25; 75 10.738,-7.75; 76 10.738,-7.25; 77 10.738,-6.75; 78 10.738,-6.25; 79 10.738,-5.75; 80 10.738,-5.25; 81 10.738,-4.75; 82 10.738,-4.25; 83 10.738,-3.75; 84 10.738,-3.25; 85 10.738,-2.75; 86 10.738,-2.25; 87 10.738,-1.75; 88 10.738,-1.25; 89 10.738,-0.75; 90 10.738,-0.25; 91 10.738,0.25; 92 10.738,0.75; 93 10.738,1.25; 94 10.738,1.75; 95 10.738,2.25; 96 10.738,2.75; 97 10.738,3.25; 98 10.738,3.75; 99 10.738,4.25; 100 10.738,4.75; 101 10.738,5.25; 102 10.738,5.75; 103 10.738,6.25; 104 10.738,6.75; 105 10.738,7.25; 106 10.738,7.75; 107 10.738,8.25; 108 10.738,8.75 | smd 0.3 x 1.475: 37 -8.75,-10.738; 38 -8.25,-10.738; 39 -7.75,-10.738; 40 -7.25,-10.738; 41 -6.75,-10.738; 42 -6.25,-10.738; 43 -5.75,-10.738; 44 -5.25,-10.738; 45 -4.75,-10.738; 46 -4.25,-10.738; 47 -3.75,-10.738; 48 -3.25,-10.738; 49 -2.75,-10.738; 50 -2.25,-10.738; 51 -1.75,-10.738; 52 -1.25,-10.738; 53 -0.75,-10.738; 54 -0.25,-10.738; 55 0.25,-10.738; 56 0.75,-10.738; 57 1.25,-10.738; 58 1.75,-10.738; 59 2.25,-10.738; 60 2.75,-10.738; 61 3.25,-10.738; 62 3.75,-10.738; 63 4.25,-10.738; 64 4.75,-10.738; 65 5.25,-10.738; 66 5.75,-10.738; 67 6.25,-10.738; 68 6.75,-10.738; 69 7.25,-10.738; 70 7.75,-10.738; 71 8.25,-10.738; 72 8.75,-10.738; 109 8.75,10.738; 110 8.25,10.738; 111 7.75,10.738; 112 7.25,10.738; 113 6.75,10.738; 114 6.25,10.738; 115 5.75,10.738; 116 5.25,10.738; 117 4.75,10.738; 118 4.25,10.738; 119 3.75,10.738; 120 3.25,10.738; 121 2.75,10.738; 122 2.25,10.738; 123 1.75,10.738; 124 1.25,10.738; 125 0.75,10.738; 126 0.25,10.738; 127 -0.25,10.738; 128 -0.75,10.738; 129 -1.25,10.738; 130 -1.75,10.738; 131 -2.25,10.738; 132 -2.75,10.738; 133 -3.25,10.738; 134 -3.75,10.738; 135 -4.25,10.738; 136 -4.75,10.738; 137 -5.25,10.738; 138 -5.75,10.738; 139 -6.25,10.738; 140 -6.75,10.738; 141 -7.25,10.738; 142 -7.75,10.738; 143 -8.25,10.738; 144 -8.75,10.738
SOT23-6 = smd 0.6 x 1.2: 1 -0.95,-1.15; 2 0,-1.15; 3 0.95,-1.15; 4 0.95,1.15; 5 0,1.15; 6 -0.95,1.15
SOT95P280X145-5N = smd 1.2 x 0.6: 1 -1.25,0.95; 2 -1.25,0; 3 -1.25,-0.95; 4 1.25,-0.95; 5 1.25,0.95
PINHEAD_2X5_127 = smd 0.75 x 2.5: 1 -2.54,-1.81; 2 -2.54,2; 3 -1.27,-1.81; 4 -1.27,2; 5 0,-1.81; 6 0,2; 7 1.27,-1.81; 8 1.27,2; 9 2.54,-1.81; 10 2.54,2
SKQGADE010 = smd 1.8 x 1.1: P$1 -3.1,1.85; P$2 3.1,1.85; P$3 -3.1,-1.85; P$4 3.1,-1.85
INDC2016X120N = smd 1.2 x 1.8: 1 -0.85,0; 2 0.85,0
2X20 = drill 1.016 octagon: 1 -24.13,-1.27; 2 -24.13,1.27; 3 -21.59,-1.27; 4 -21.59,1.27; 5 -19.05,-1.27; 6 -19.05,1.27; 7 -16.51,-1.27; 8 -16.51,1.27; 9 -13.97,-1.27; 10 -13.97,1.27; 11 -11.43,-1.27; 12 -11.43,1.27; 13 -8.89,-1.27; 14 -8.89,1.27; 15 -6.35,-1.27; 16 -6.35,1.27; 17 -3.81,-1.27; 18 -3.81,1.27; 19 -1.27,-1.27; 20 -1.27,1.27; 21 1.27,-1.27; 22 1.27,1.27; 23 3.81,-1.27; 24 3.81,1.27; 25 6.35,-1.27; 26 6.35,1.27; 27 8.89,-1.27; 28 8.89,1.27; 29 11.43,-1.27; 30 11.43,1.27; 31 13.97,-1.27; 32 13.97,1.27; 33 16.51,-1.27; 34 16.51,1.27; 35 19.05,-1.27; 36 19.05,1.27; 37 21.59,-1.27; 38 21.59,1.27; 39 24.13,-1.27; 40 24.13,1.27
SOT563 = smd 0.7 x 1.4: P$1 0.95,1.4; P$2 0,1.4; P$3 -0.95,1.4; P$4 -0.95,-1.4; P$5 0.95,-1.4
0603_AK = smd 0.85 x 0.7: A -0.775,0; K 0.775,0
SSM3J332RLFT = smd 0.8 x 0.9: 1 -0.95,-1.05; 2 0.95,-1.05; 3 0,1.05
R0402 = smd 0.6 x 0.7: 1 -0.5,0; 2 0.5,0
TVS0402 = smd 0.6 x 0.6: 1 -0.508,0; 2 0.508,0
WIRELESS-LORA-RFM95W#SMD = smd 3.6 x 1.2: A1 -7.5,7; A2 -7.5,5; A3 -7.5,3; A4 -7.5,1; A5 -7.5,-1; A6 -7.5,-3; A7 -7.5,-5; A8 -7.5,-7; B1 7.5,7; B2 7.5,5; B3 7.5,3; B4 7.5,1; B5 7.5,-1; B6 7.5,-3; B7 7.5,-5; B8 7.5,-7
1X06 = drill 1.016 long: 1 -6.35,0; 2 -3.81,0; 3 -1.27,0; 4 1.27,0; 5 3.81,0; 6 6.35,0
47346-0001 = smd 0.45 x 1.38: 1 1.3,-4.81; 2 0.65,-4.81; 3 0,-4.81; 4 -0.65,-4.81; 5 -1.3,-4.81 | smd 1.475 x 2.1: 6 -2.453,-4.45; 7 2.453,-4.45 | smd 1.175 x 1.9: 8 0.838,-2.15; 9 -0.838,-2.15 | smd 2.375 x 1.9: 10 2.913,-2.15; 11 -2.913,-2.15

### Placement (x,y rotation side)
3V3  25.17,20.74 270 top
5V  63.07,14.97 270 top
ANT1  120.33,57.71 0 top
BAT0  37.78,3.24 0 top
BAT1  26.28,3.38 0 top
C1  17.32,13.81 90 top
C2  62.95,66.39 268.7 top
C3  76.93,41.72 139 top
C4  56.74,3.6 0 top
C5  52.59,15.7 0 top
C6  55.75,15.76 180 top
C7  116.75,55.91 90 top
C8  85.01,3.86 90 top
C9  23.14,58.98 180 top
C12  30.34,21.49 90 top
C14  28.31,13.21 90 top
C17  16.86,58.05 0 top
C18  56.18,20.44 0 top
C19  56.2,22.04 0 top
C20  51.25,24.69 180 top
C21  51.2,17.73 180 top
CD-32KHZ  59.43,21.25 270 top
CD_8MHZ  46.21,21.79 90 top
D1  55.51,6.58 180 top
GPIO1  98.82,67.02 180 top
I2C1  40.11,75.99 0 top
IC1  60.55,45.78 45.5 top
IC2  26.96,64.59 90 top
IC5  55.8,12.42 90 top
JP1  83.28,78.08 180 top
JP3  33.06,14.02 90 top
JP4  74.63,69.62 0 top
JP5  83.3,15.19 0 top
JP6  37.06,20.47 270 top
L1  51.7,11.94 270 top
LCD  6.23,42.98 270 bottom
LDO  21.45,13.62 270 top
LED1  98.74,75.12 90 top
LED2  98.93,59.28 270 top
LED3  96.11,75.08 90 top
LED4  96.39,59.29 270 top
Q1  17,64.89 0 top
Q2  21.98,64.9 0 top
Q3  113.51,51.21 180 top
Q4  41.09,12.51 270 top
Q5  84.81,8.73 0 top
R1  50.59,21.17 90 top
R2  121.68,51.65 270 top
R3  122.3,47.59 180 top
R4  54.26,3.6 180 top
R5  16.95,60.13 180 top
R6  98.88,62.69 90 top
R7  21.97,60.72 180 top
R8  114.47,56.02 270 top
R9  96.1,71.51 270 top
R10  96.33,62.54 90 top
R11  98.71,71.57 270 top
R12  23.03,57.68 180 top
R13  44.96,77.22 0 top
R14  112.64,57.14 270 top
R15  45.08,74.57 0 top
R16  33.2,19.35 270 top
R17  31.4,65.56 0 top
R18  31.41,63.7 0 top
R19  87.48,45.39 270 top
R20  87.47,55.31 90 top
R21  82.8,4.41 180 top
R22  87.35,4.43 180 top
R23  37.23,13.13 90 top
R25  19.31,57.53 90 top
SPI2  87.47,50.56 180 top
TVS1  25.82,13.17 270 top
TVS2  15.1,13.88 270 top
U1  114.7,35.43 90 top
UART1  86.63,59.2 0 bottom
UART2  74.16,15.16 0 bottom
US1  26.51,72.14 0 top
US2  26.58,77.53 0 top
USB  64.63,79.92 0 top

### Tracks (layer width: path | path; a pad name or v marks a point on that pad's centre or on a via)
3V3  (via drill 0.35)
  Top 0.305: 12.72,16.64 12.64,16.72 7.29,16.72 6.25,17.76 6.25,20.1 LCD.38 3.5,22.85 3.5,63.11 LCD.4 5.23,64.57 6.5,63.3 9.6,63.3 9.87,63.02 9.87,58.69 11.46,57.1 19.24,57.1 R25.1 22.1,57.03 22.1,57.02 23.11,57.02 23.15,56.99 23.53,57.37 R12.1 24.34,57.68 24.67,58.01 24.67,63.23 25.08,63.64 IC2.6 25.81,63.1 26.15,62.76 31.33,62.76 32.01,63.44 R18.2 R17.2 32,70.16 32.14,70.3 34.9,70.3 36.17,71.57 36.17,74.01 36.88,74.72 I2C1.1 38.84,75.31 39.34,75.81 45.64,75.81 45.68,75.77 | 12.72,16.64 13.09,16.27 13.09,14.33 14.05,13.37 TVS2.2 17.17,13.37 C1.1 17.92,12.61 19.99,12.61 LDO.P$5 | R15.2 45.68,75.77 | 45.68,75.77 45.68,77.1 R13.2 59.37,77.22 60.14,77.99 60.14,80.27 61.45,81.58 85.56,81.58 85.65,81.49 | 85.65,81.49 85.88,81.26 85.88,79.95 JP1.1 | 85.65,81.49 100.64,81.49 101.37,80.76 GPIO1.1 102.95,66.7 102.95,64.52 103.45,64.02 110.73,64.02 112.67,62.08 112.67,57.67 R14.1 | v88.88,64.85 88.88,61 88.96,60.91 88.96,59 UART1.1 | UART1.1 90.01,55.82 SPI2.1 89.74,51.83 88.87,50.96 88.87,46.11 87.97,45.22 87.91,45.22 R19.2 87.48,40.41 v87.53,40.36 | UART1.1 87.42,57.45 87.42,55.96 R20.2 | 12.72,16.64 24.44,16.64 24.47,16.61 25.17,17.31 3V3.2 | R22.1 87.85,8.81 85.92,10.74 85.92,15.11 JP5.4 83.3,15.2 81.44,15.2 80.13,13.89 UART2.1
  Bottom 0.305: v88.88,64.85 91.24,64.85 95.93,69.55 100.3,69.55 101.36,68.49 GPIO1.1 | v87.53,40.36 87.53,19.42 JP5.4
3V3_LORA
  Top 0.305: Q3.3 113.7,49.97 U1.B4
3V3_STM  (via drill 0.35)
  Top 0.305: 3V3.1 30.26,22.01 C12.2 30.34,26.91 31.63,28.2 44.16,28.2 v44.38,27.98 | v45.01,31.49 45.33,31.49 IC1.17 53.97,40.13 53.97,41.99 49.46,46.49 48.71,46.49 | IC1.108 60.12,57.86 | 60.12,57.86 56.38,54.12 56.34,54.12 | 56.34,54.12 56,54.12 54.85,55.27 IC1.121 | IC1.144 46.82,47.06 47.4,46.49 47.65,46.49 48.71,46.49 | 48.71,46.49 52.46,50.24 | 52.46,50.24 52.46,50.55 IC1.131 | 52.46,50.24 56.34,54.12 | IC1.30 57.92,34.89 59.33,34.89 | IC1.39 60.61,34.89 60.04,34.89 | 59.33,34.89 60.04,34.89 | IC1.32 59.33,34.89 | IC1.33 60.04,34.89 | 60.04,34.89 63.8,38.65 | 63.8,38.65 68.06,42.91 69,42.91 v69.12,42.8 | IC1.52 66.04,38.65 63.8,38.65 | IC1.95 65.51,54.06 | v61.79,56.37 64.11,54.06 65.51,54.06 | v60.63,57.48 60.5,57.48 60.12,57.86 | 65.51,54.06 65.51,53.21 v65.54,53.19 | v68.49,50.32 68.59,50.32 | 68.59,50.32 69.55,50.32 IC1.84 | IC1.72 73.04,45.79 | 73.04,45.79 68.59,50.24 68.59,50.32 | 73.04,45.79 70.25,43 70.25,41.57 70.83,40.98 IC1.62 70.13,41.63 70.13,41.8 v69.73,42.2
  Bottom 0.305: v45.01,31.49 44.38,30.87 v44.38,27.98 | v61.79,56.37 61.73,56.37 v60.63,57.48 | v65.54,53.19 68.41,50.32 v68.49,50.32 | v69.12,42.8 v69.72,42.2 v69.73,42.2
5V  (via drill 0.35)
  Top 0.152: 57.34,6.5 D1.1
  Top 0.305: LCD.6 6.34,60.65 8.68,60.65 9.41,59.91 9.41,52.93 10.8,51.54 41.82,51.54 v41.93,51.65 | IC5.4 56.62,13.79 C6.1 | 5V.1 5V.3 61.77,13.67 IC5.4 | D1.1 57.35,6.67 57.35,10.44 57.35,13.19 56.88,13.67 IC5.4 | C4.2 57.34,6.5
  Bottom 0.305: v41.93,51.65 43.65,51.65 58.85,36.45 58.85,17.08 59.69,16.24 5V.1
ANT
  Top 0.305: R2.2 121.68,47.61 R3.2 U1.B8
CS  (via drill 0.35)
  Top 0.305: LCD.12 6.05,53.32 7.56,53.32 8.56,52.31 8.56,52.25 10.42,50.4 43.63,50.4 v43.77,50.54 | IC1.49 65.68,36.89 65.01,36.89 63.83,35.71 61.9,35.71 v61.88,35.69 | v59.53,25.92 59.3,26.15 59.26,26.15 56.74,28.67 v56.74,31.48
  Bottom 0.305: v61.88,35.69 59.53,33.34 v59.53,25.92 | v56.74,31.48 42.49,45.73 42.49,49.26 v43.77,50.54
EN_3V3_1
  Top 0.305: Q2.1 21.47,63.41 R7.2
EN_3V3_2
  Top 0.305: Q1.1 16.45,63.44 R5.2
EN_3V3_3  (via drill 0.35)
  Top 0.305: Q5.1 83.87,5.58 | 83.87,5.58 83.67,5.38 82.85,5.38 82.3,4.83 R21.2 | IC1.77 74.47,50.29 v74.47,50.55 | v84.8,5.73 84.65,5.58 83.87,5.58
  Bottom 0.305: v74.47,50.55 74.66,50.36 87.91,50.36 88.53,49.73 88.53,40.53 88.54,40.53 88.54,6.54 87.73,5.73 v84.8,5.73
EN_LORA  (via drill 0.35)
  Top 0.305: Q3.1 R8.2 114.22,55.27 v113.38,55.27 | IC1.100 67.81,59.89 v67.81,60.15
  Bottom 0.305: v113.38,55.27 112.07,55.27 111.28,56.05 111.28,62.9 110.28,63.91 71.57,63.91 v67.81,60.15
GND  (via drill 0.35)
  Top 0.305: C20.1 51.87,24.67 v51.87,22.59 | v53.39,22.18 55.46,22.18 C19.1 | IC1.107 61.35,58.38 v61.35,58.12 | v62.05,63.89 62.05,66.46 62.58,66.99 C2.1 | IC1.16 53.3,40.17 53.3,42.01 49.34,45.97 43.89,45.97 43.65,46.21 v43.55,46.21 | IC2.2 29.86,64.59 v29.89,64.62 | IC1.31 56.85,33.11 56.02,33.11 55.97,33.16 v55.97,33.22
  Bottom 0.305: v51.87,22.59 52.28,22.18 v53.39,22.18 | v61.35,58.12 61.35,59.79 62.34,60.79 62.34,63.59 v62.05,63.89 | v29.89,64.62 v29.89,66.41 v29.9,66.42 | v55.97,33.22 43.55,45.64 v43.55,46.21
  pour Bottom: 105.08,0.09 19.5,0.09 arc-90 0.09,19.5 0.09,59.59 arc-90 23.63,83.13 105.45,83.13 arc-90 124.5,64.08 124.5,19.5 arc-90
  pour Top: -0.14,52.1 -0.14,59.27 arc-90 23.9,83.31 105.16,83.31 arc-90 124.59,63.88 124.59,19.87 arc-90 104.68,-0.04 19.71,-0.04 arc-90 0.14,19.53 0.14,51.86 arc90 -0.13,52.13
GPIO_0  (via drill 0.35)
  Top 0.305: IC1.96 76.28,65.53 93.4,65.53 v94.13,64.81 | R6.2 98.88,65.69 GPIO1.4
  Bottom 0.305: v94.13,64.81 94.42,64.52 98.43,64.52 98.82,64.91 GPIO1.4
GPIO_1  (via drill 0.35)
  Top 0.305: IC1.97 76.03,65.99 94.02,65.99 v94.25,65.77 | GPIO1.3 98.82,70.96 R11.2
  Bottom 0.305: v94.25,65.77 95.7,67.22 96.72,67.22 96.73,67.23 97.83,67.23 98.82,68.22 GPIO1.3
GPIO_2
  Top 0.305: 96.24,65.75 95.92,65.75 95.21,66.46 94.76,66.46 94.77,66.45 75.78,66.45 IC1.98 | 96.24,65.75 GPIO1.6 | R10.2 96.33,65.66 96.24,65.75
GPIO_3
  Top 0.305: IC1.99 75.54,66.91 78.75,66.91 78.78,66.94 94.93,66.94 GPIO1.5 96.2,68.37 96.2,70.91 R9.2
I2C1_SCL  (via drill 0.35)
  Top 0.305: I2C1.3 44.33,74.72 R15.1 | IC1.139 47.55,49.81 v47.55,50.07
  Bottom 0.305: v47.55,50.07 41.38,56.24 I2C1.3
I2C1_SDA  (via drill 0.35)
  Top 0.305: I2C1.4 44.32,77.26 R13.1 | IC1.137 48.25,50.52 v48.25,50.65
  Bottom 0.305: v48.25,50.65 41.86,57.04 41.86,73.69 42.44,74.28 42.44,75.16 42.43,75.18 42.43,76.42 41.59,77.26 I2C1.4
I2C4_SCL  (via drill 0.35)
  Top 0.305: US2.3 25.31,72.21 US1.3 26.67,70.71 26.67,66.01 26.71,65.96 26.71,64.29 27.37,63.64 IC2.1 30.75,63.64 R18.1 | IC1.54 66.88,39.23 v66.74,39.23 v66.73,39.22
  Bottom 0.305: v66.73,39.22 64.66,37.15 58.79,37.15 43.61,52.33 35.72,52.33 35.67,52.38 27.44,52.38 26.63,53.2 26.63,70.75 US1.3
I2C4_SDA  (via drill 0.35)
  Top 0.305: US2.4 27.85,72.21 US1.4 28.11,71.81 IC2.3 30.78,65.54 R17.1 | IC1.55 67.41,39.4 67.41,39.59 67.07,39.93 v66.15,39.93
  Bottom 0.305: v66.15,39.93 63.83,37.61 58.98,37.61 43.8,52.79 36.27,52.79 36.22,52.84 27.63,52.84 27.08,53.39 27.08,71.45 US1.4
LCD_D0
  Top 0.305: IC1.19 46.78,31.52 45.61,30.35 17.41,30.35 14.12,27.06 14.12,20.23 12.74,18.85 LCD.39
LCD_D1
  Top 0.305: IC1.18 45.35,30.81 17.22,30.81 13.66,27.25 13.66,21.97 13.08,21.39 LCD.37
LCD_D2
  Top 0.305: IC1.15 43.69,31.26 17.03,31.26 13.2,27.44 13.2,24.59 12.54,23.93 LCD.35
LCD_D3
  Top 0.305: IC1.14 43.44,31.72 16.84,31.72 12.74,27.63 12.74,26.85 12.29,26.39 7.58,26.39 LCD.33
LCD_D4
  Top 0.305: IC1.13 43.19,32.18 16.61,32.18 13.39,28.96 7.55,28.96 LCD.31
LCD_D5
  Top 0.305: IC1.12 42.99,32.69 16.47,32.69 15.33,31.55 LCD.29
LCD_D6
  Top 0.305: IC1.11 42.74,33.15 16.01,33.15 14.93,34.23 7.64,34.23 LCD.27
LCD_D7
  Top 0.305: IC1.10 42.49,33.6 16.43,33.6 13.24,36.8 7.67,36.8 LCD.25
LORA_DIO0
  Top 0.305: IC1.48 65.95,35.93 66.58,35.31 109.71,35.31 111.69,37.29 U1.B3
LORA_DIO1
  Top 0.305: IC1.69 77.6,39.11 109.22,39.11 109.7,39.59 U1.B2
LORA_DIO2
  Top 0.305: IC1.70 77.74,39.68 107.47,39.68 107.79,40 107.79,42.84 U1.B1
LORA_DIO3
  Top 0.305: IC1.46 65.25,35.22 66.19,34.28 116.78,34.28 117.7,35.2 U1.B6
LORA_DIO4
  Top 0.305: IC1.47 66.37,34.78 114.33,34.78 115.7,36.15 U1.B5
LORA_DIO5
  Top 0.305: IC1.45 65.95,33.8 119.44,33.8 119.83,33.42 119.83,28.06 U1.A7
LORA_RST
  Top 0.305: IC1.44 65.7,33.34 117.46,33.34 117.7,33.1 U1.A6
N$6  (via drill 0.35)
  Top 0.305: v63.03,60.96 63.03,59.86 63.12,59.77 63.12,59.44 IC1.106 | v62.96,64.05 62.93,64.07 C2.2
  Bottom 0.305: v63.03,60.96 63.03,63.98 v62.96,64.05
N$8
  Top 0.305: L1.2 54.61,11.09 | 54.61,11.09 54.77,11.09 IC5.1 | R4.2 D1.2 53.76,10.24 54.61,11.09
N$9
  Top 0.305: R4.1 C4.1
N$16
  Top 0.305: C5.1 51.7,15.68 L1.1 51.42,12.51 Q4.3
N$17
  Top 0.305: ANT1.SIG 120.53,55.93 120.53,53.23 121.51,52.25 R2.1
N$23
  Top 0.305: C7.2 R8.1 114.35,56.64 R14.2 112.64,52.34 Q3.2
N$24
  Top 0.305: R11.1 98.71,74.31 LED1.A
N$25
  Top 0.305: LED2.A 98.93,62.14 R6.1
N$28
  Top 0.305: Q1.2 17.95,63.79 17.45,63.29 R5.1 C17.2 17.48,58.03 R25.2
N$30
  Top 0.305: LED3.A R9.1
N$31
  Top 0.305: R10.1 96.33,60.12 LED4.A
N$32
  Top 0.305: R21.1 84.96,4.41 C8.2 | Q5.2 85.76,5.64 85.01,4.89 C8.2 | C8.2 86.82,4.46 R22.2
N$33
  Top 0.305: Q5.3 84.81,13.68 JP5.3
N$34
  Top 0.305: Q2.2 22.6,63.52 22.48,63.52 22.47,63.51 R7.1 22.47,59.05 C9.2 R12.2
N$71
  Top 0.305: IC1.71 75.52,42.61 75.98,42.61 C3.2
NRST  (via drill 0.35)
  Top 0.305: JP1.10 80.74,72.6 79.61,71.47 JP4.P$2 JP4.P$1 67.78,71.47 67.21,70.9 67.21,61.28 v67.44,61.06 | IC1.25 58.31,38.81 v58.31,39.24
  Bottom 0.305: v67.44,61.06 52.11,45.73 52.11,45.15 58.01,39.24 v58.31,39.24
RCC_OSC32_IN  (via drill 0.35)
  Top 0.305: C18.2 58.24,20.44 | 58.24,20.44 59.37,20.44 CD-32KHZ.P$2 | v58.13,21.29 58.13,20.55 58.24,20.44 | IC1.8 50.7,43.23 v50.85,43.23
  Bottom 0.305: v58.13,21.29 58.24,21.4 58.24,35.84 v50.85,43.23
RCC_OSC32_OUT  (via drill 0.35)
  Top 0.305: C19.2 56.99,22.04 | 56.99,22.04 59.39,22.04 CD-32KHZ.P$1 | IC1.9 50.49,42.31 v50.75,42.31 | v57.55,23.53 57.55,22.61 56.99,22.04
  Bottom 0.305: v50.75,42.31 57.55,35.5 v57.55,23.53
RCC_OSC_IN
  Top 0.305: IC1.23 46.27,28.19 45.57,28.19 45.01,27.63 45.01,25.47 | R1.2 50.59,24.63 C20.2 50.65,25.52 50.44,25.73 45.27,25.73 45.01,25.47 | 45.01,25.47 CD_8MHZ.3
RCC_OSC_OUT
  Top 0.305: IC1.24 52.71,33.92 52.71,21.4 51.88,20.57 R1.1 | R1.1 C21.2 | CD_8MHZ.1 47.44,19.62 49.66,19.62 R1.1
RD  (via drill 0.35)
  Top 0.305: v18,29.67 18.15,29.82 45.78,29.82 IC1.20
  Bottom 0.305: v18,29.67 8.35,29.67 7.94,30.08 6.43,30.08 LCD.30
RS  (via drill 0.35)
  Top 0.305: IC1.22 46.03,28.66 19.01,28.66 v18.2,27.85
  Bottom 0.305: v18.2,27.85 8.89,27.85 8.62,27.58 8.62,25.42 8.29,25.09 5.74,25.09 4.96,25.87 LCD.34
RST  (via drill 0.35)
  Top 0.305: LCD.8 4.96,58.99 5.65,58.3 8.24,58.3 8.96,57.58 8.96,52.56 9.02,52.5 9.02,52.44 10.54,50.92 43.19,50.92 43.94,51.67 48.25,51.67 v48.37,51.55 | v52.65,47.23 60.65,39.22 v60.65,36.47 | IC1.50 65.49,37.79 64.78,37.79 63.55,36.56 v63.55,36.4
  Bottom 0.305: v48.37,51.55 52.65,47.28 v52.65,47.23 | v63.55,36.4 60.72,36.4 v60.65,36.47
SHUTDOWN
  Top 0.305: R16.2 33.2,15.43 JP3.2 32.34,14.58 27.81,14.58 27.8,14.57 LDO.P$3
SPI1_MISO
  Top 0.305: IC1.42 63.89,33.79 65.27,32.41 108.94,32.41 109.7,31.66 U1.A2
SPI1_MOSI
  Top 0.305: IC1.43 64.2,34.15 65.48,32.87 111.45,32.87 111.7,32.62 U1.A3
SPI1_NSS  (via drill 0.35)
  Top 0.305: IC1.40 64.81,31.4 105.34,31.4 v106.01,30.73 | v114.68,30.66 115.57,30.66 115.88,30.35 115.88,28.11 U1.A5
  Bottom 0.305: v106.01,30.73 114.61,30.73 v114.68,30.66
SPI1_SCK  (via drill 0.35)
  Top 0.305: IC1.41 63.53,33.44 65.02,31.95 105.85,31.95 v106.08,31.73 | v112.6,31.72 113.2,31.72 113.76,31.16 113.76,27.99 U1.A4
  Bottom 0.305: v106.08,31.73 v112.59,31.73 v112.6,31.72
SPI2_MISO  (via drill 0.35)
  Top 0.305: R19.1 SPI2.4 | IC1.28 v59.91,38.29 v59.92,38.29
  Bottom 0.305: v59.92,38.29 63.37,38.29 73.28,48.2 86.38,48.2 SPI2.4
SPI2_MOSI  (via drill 0.35)
  Top 0.305: IC1.27 59.01,38.1 v59.01,38.66
  Bottom 0.305: v59.01,38.66 59.57,39.22 63.45,39.22 73.25,49.01 73.53,49.29 SPI2.6
SPI2_NSS
  Top 0.305: IC1.73 80.77,53.76 84.62,53.76 84.93,53.46 SPI2.5
SPI2_SCK
  Top 0.305: IC1.74 80.52,54.22 86.35,54.22 87.47,53.1 | 87.47,53.1 SPI2.3 | R20.1 87.47,53.1
SUP_EN
  Top 0.305: Q4.1 39.96,13.38 38.78,13.38 38.53,13.63 R23.2 37.23,19.03 JP6.2
SWDCLK  (via drill 0.35)
  Top 0.305: IC1.109 59.29,59.28 64.07,64.07 64.07,71.96 v63.94,72.09 | v84.46,72.67 84.46,75.99 JP1.4
  Bottom 0.305: v63.94,72.09 83.88,72.09 v84.46,72.67
SWDIO  (via drill 0.35)
  Top 0.305: IC1.105 63.94,59.56 v63.94,60.96 | v85.84,72.69 85.84,76.06 JP1.2
  Bottom 0.305: v63.94,60.96 63.94,71.04 64.54,71.63 84.78,71.63 v85.84,72.69
TCLK
  Top 0.305: IC1.2 37.75,34.52 17.28,34.52 12.63,39.17 LCD.23
TCS
  Top 0.305: IC1.1 37.5,34.97 17.48,34.97 10.75,41.71 LCD.21
TDIN  (via drill 0.35)
  Top 0.305: IC1.141 47.75,48.13 46.02,49.86 9.8,49.86 v9.42,50.24
  Bottom 0.305: v9.42,50.24 8.6,49.42 8.6,45.21 7.64,44.25 LCD.19
TDO
  Top 0.305: IC1.142 45.83,49.4 8.27,49.4 8.12,49.25 7.58,49.25 LCD.15
TIRQ
  Top 0.305: IC1.3 38,34.06 16.85,34.06 12.86,38.06 6.71,38.06 6.13,38.64 6.13,50.72 7.28,51.87 LCD.13
US1_INT  (via drill 0.35)
  Top 0.305: v29.01,53.64 47.25,53.64 48.31,52.58 49.43,51.46 | IC1.134 49.43,51.46 | IC1.135 49.43,50.75 49.43,51.46
  Bottom 0.305: v29.01,53.64 29.01,70.83 US1.5
USART1_RX
  Top 0.305: IC1.76 83.48,58.59 83.48,59.66 84.29,60.47 UART1.4
USART1_TX
  Top 0.305: IC1.75 83.52,57.93 UART1.3
USART2_CTS
  Top 0.305: IC1.34 58.55,32.63 57.42,31.5 57.42,28.63 59.45,26.6 65.46,26.6 70.27,21.79 70.27,15.05 71.43,13.89 UART2.5
USART2_RTS
  Top 0.305: IC1.35 58.9,32.28 57.88,31.25 57.88,28.82 59.64,27.06 65.65,27.06 71.62,21.09 UART2.6
USART2_RX
  Top 0.305: IC1.37 74.16,19.93 UART2.4
USART2_TX
  Top 0.305: IC1.36 58.34,31.06 58.34,29.01 59.83,27.52 65.92,27.52 72.97,20.47 72.97,15.08 UART2.3
USB_OTG_FS_DM
  Top 0.305: IC1.103 65.28,59.48 USB.2
USB_OTG_FS_DP
  Top 0.305: IC1.104 64.63,59.54 USB.3
USB_OTG_FS_ID  (via drill 0.35)
  Top 0.305: IC1.102 65.96,59.46 v65.96,73.32 | v63.94,73.29 63.98,73.32 USB.4
  Bottom 0.305: v65.96,73.32 65.93,73.29 v63.94,73.29
USB_OTG_FS_VBUS
  Top 0.305: IC1.101 66.11,58.9 66.27,59.06 66.76,59.55 66.76,73.57 66.04,74.29 66.04,75 USB.1
VBAT  (via drill 0.35)
  Top 0.305: IC1.6 40.35,34.29 v39.19,34.29 | Q4.2 40,11.52 38.9,11.52 37.79,12.63 R23.1 33.18,12.63 JP3.1 32.92,12.61 C14.1 28.26,12.66 TVS1.2 25.8,12.67 LDO.P$1
  Top 0.508: BAT1.1 27.28,6.97 32.92,12.61 | BAT0.1 38.71,3.31 38.71,7.1 JP3.1
  Bottom 0.305: v39.19,34.29 39.19,13.96 37.98,12.75 JP3.1
VCC_US1
  Top 0.305: Q2.3 20.26,67.67 20.26,72.04 US1.1
VCC_US2
  Top 0.305: Q1.3 17,74.3 US2.1
WR  (via drill 0.35)
  Top 0.305: IC1.21 53.85,37.24 53.68,37.08 53.27,36.66 45.82,29.21 18.57,29.21 v18.12,28.76
  Bottom 0.305: v18.12,28.76 8.75,28.76 7.94,27.94 5.63,27.94 5.6,27.91 4.96,28.55 LCD.32